# EAGLE design beacon1 (EAGLE 9.2.1)
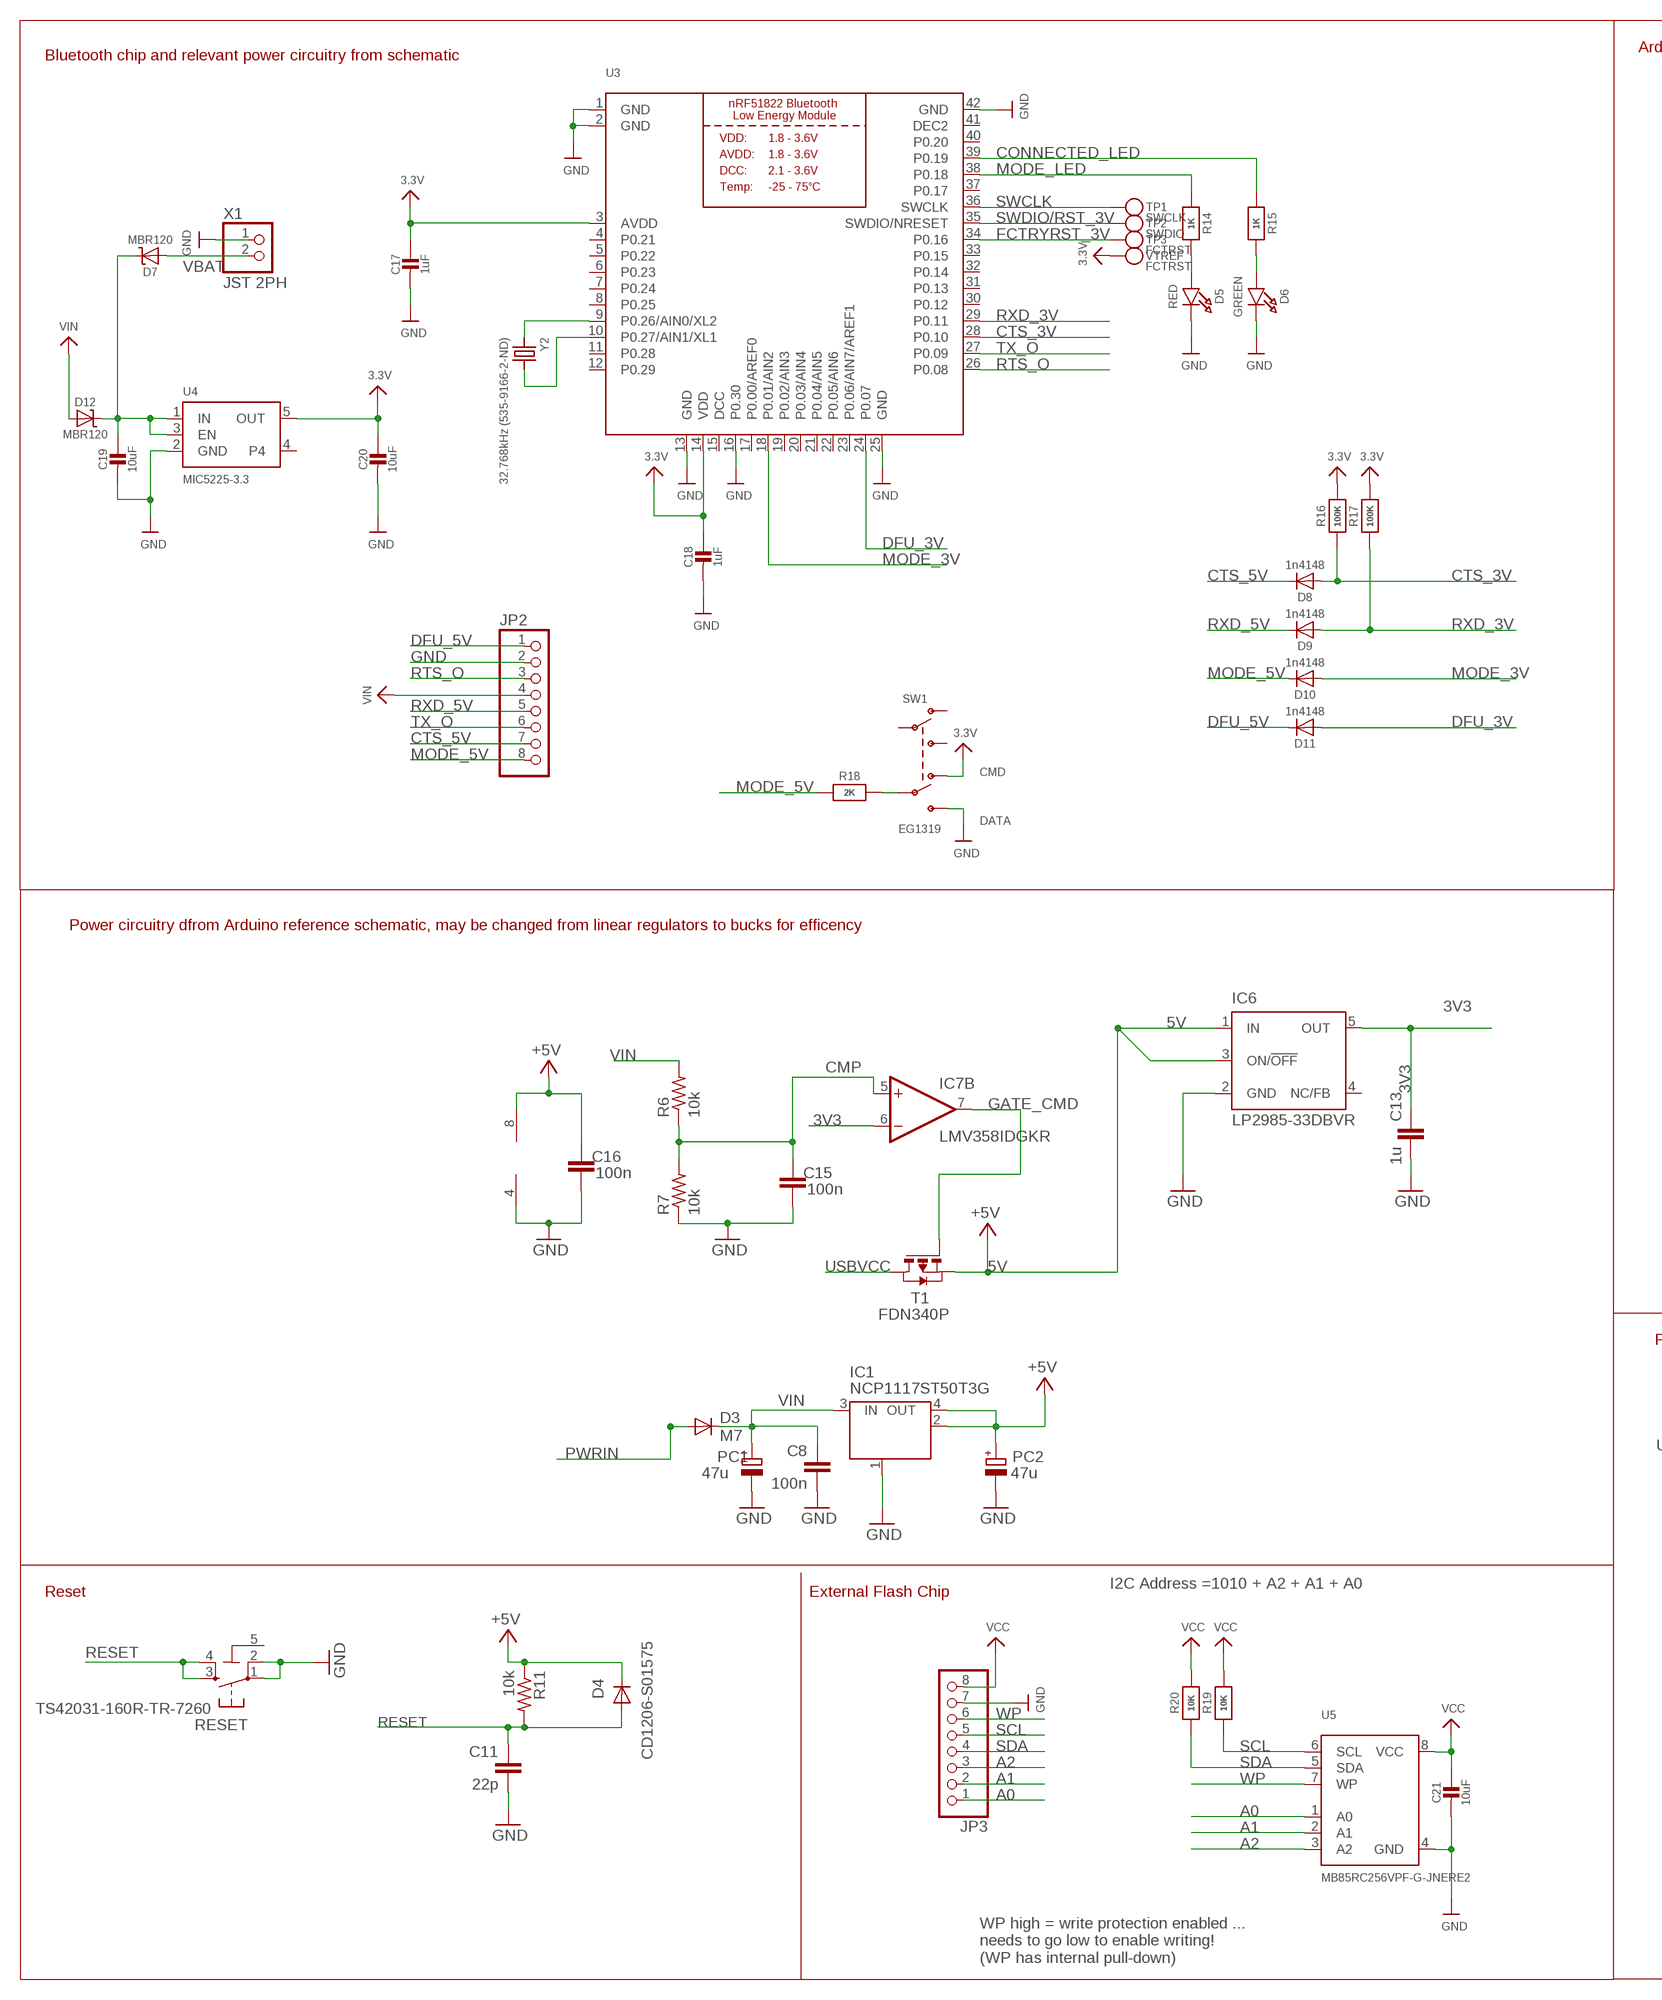
[diagram p0: schematic, sheet 1, part 1 of 2]
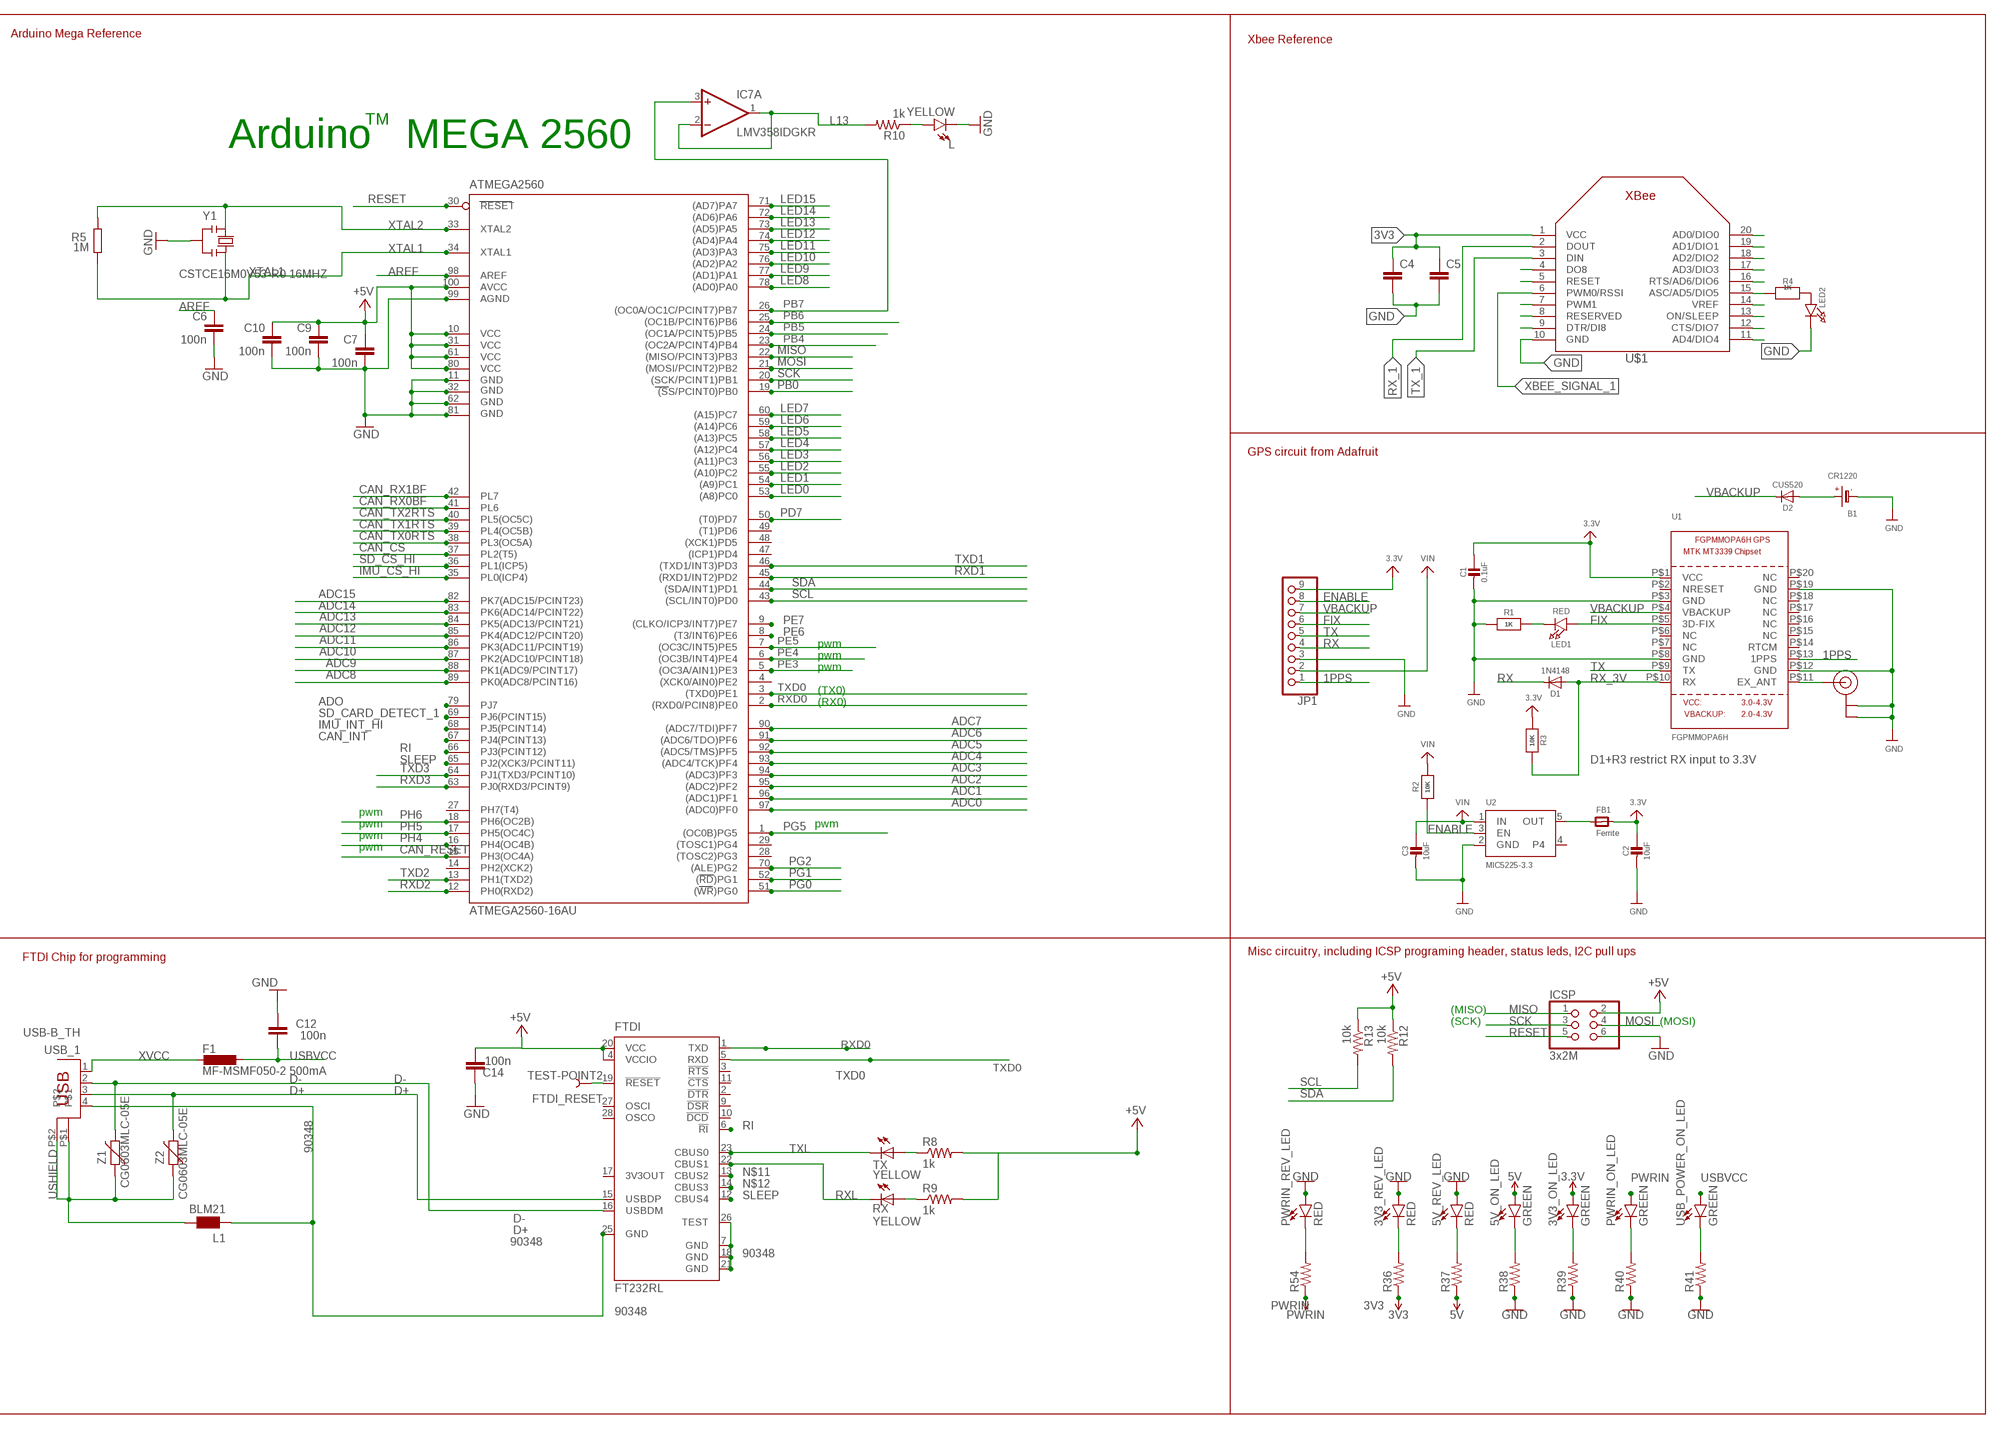
[diagram p1: schematic, sheet 1, part 2 of 2]

## Parts
3V3_ON_LED  GREEN  LED-GREENLILYPAD  [LED-1206]
3V3_REV_LED  RED  LED-RED1206  [LED-1206]
5V_ON_LED  GREEN  LED-GREENLILYPAD  [LED-1206]
5V_REV_LED  RED  LED-RED1206  [LED-1206]
ATMEGA2560  ATMEGA2560-16AU  ATMEGA2560AU  [TQFP100]
B1  CR1220  BATTERYCR1220_SMT  [CR1220]
C1  0.1uF  CAP_CERAMIC0805-NOOUTLINE  [0805-NO]
C2  10uF  CAP_CERAMIC0805-NOOUTLINE  [0805-NO]
C3  10uF  CAP_CERAMIC0805-NOOUTLINE  [0805-NO]
C4  CC1206  [C1206]
C5  CC1206  [C1206]
C6  100n  C-EUC1206K  [C1206K]
C7  100n  C-EUC1206K  [C1206K]
C8  100n  C-EUC1206K  [C1206K]
C9  100n  C-EUC1206K  [C1206K]
C10  100n  C-EUC1206K  [C1206K]
C11  22p  C-EUC1206K  [C1206K]
C12  100n  C-EUC1206K  [C1206K]
C13  1u  C-EUC1206K  [C1206K]
C14  100n  C-EUC1206K  [C1206K]
C15  100n  C-EUC1206K  [C1206K]
C16  100n  C-EUC1206K  [C1206K]
C17  1uF  CAP_CERAMIC0805-NOOUTLINE  [0805-NO]
C18  1uF  CAP_CERAMIC0805-NOOUTLINE  [0805-NO]
C19  10uF  CAP_CERAMIC0805-NOOUTLINE  [0805-NO]
C20  10uF  CAP_CERAMIC0805-NOOUTLINE  [0805-NO]
C21  10uF  CAP_CERAMIC_0805MP  [_0805MP]
D1  1N4148  DIODESOD-323  [SOD-323]
D2  CUS520  DIODESOD-323  [SOD-323]
D3  M7  DIODE-SMB  [SMB]
D4  CD1206-S01575  DIODE-MINIMELF  [MINIMELF]
D5  RED  LED0805_NOOUTLINE  [CHIPLED_0805_NOOUTLINE]
D6  GREEN  LED0805_NOOUTLINE  [CHIPLED_0805_NOOUTLINE]
D7  MBR120  DIODE-SCHOTTKYSOD-123  [SOD-123]
D8  1n4148  DIODESOD-323  [SOD-323]
D9  1n4148  DIODESOD-323  [SOD-323]
D10  1n4148  DIODESOD-323  [SOD-323]
D11  1n4148  DIODESOD-323  [SOD-323]
D12  MBR120  DIODE-SCHOTTKYSOD-123  [SOD-123]
F1  MF-MSMF050-2 500mA  L-EUL1812  [L1812]
FB1  Ferrite  FERRITE-0805NO  [0805-NO@1]
FTDI  FT232RL  [SSOP28]
FTDI_RESET  TEST-POINT2  [PAD.02X.02]
IC1  NCP1117ST50T3G  MC33269ST-3.3T3  [SOT223]
IC6  LP2985-33DBVR  LP2985-XXDBVR33  [SOT23-DBV]
IC7  LMV358IDGKR  LMV358MMX  [MSOP08]
ICSP  3x2M  PINHD-2X3  [2X03]
JP1  HEADER-1X970MIL  [1X09_ROUND_70]
JP2  HEADER-1X876MIL  [1X08_ROUND_76]
JP3  HEADER-1X870MIL  [1X08_ROUND_70]
L  YELLOW  LED1206  [LED-1206]
L1  BLM21  WE-CBF_0805  [0805]
LED1  RED  LED0805  [CHIPLED_0805]
LED2  LED1206  [CHIPLED_1206]
PC1  47u  CPOL-EUD  [PANASONIC_D]
PC2  47u  CPOL-EUD  [PANASONIC_D]
PWRIN_ON_LED  GREEN  LED-GREENLILYPAD  [LED-1206]
PWRIN_REV_LED  RED  LED-RED1206  [LED-1206]
R1  1K  RESISTOR0805_NOOUTLINE  [0805-NO]
R2  10K  RESISTOR0805_NOOUTLINE  [0805-NO]
R3  10K  RESISTOR0805_NOOUTLINE  [0805-NO]
R4  1K  RESISTOR0805_NOOUTLINE  [0805-NO]
R5  1M  R-EU_R1206  [R1206]
R6  10k  R-US_M1206  [M1206]
R7  10k  R-US_M1206  [M1206]
R8  1k  R-US_M1206  [M1206]
R9  1k  R-US_M1206  [M1206]
R10  1k  R-US_M1206  [M1206]
R11  10k  R-US_M1206  [M1206]
R12  10k  R-US_M1206  [M1206]
R13  10k  R-US_M1206  [M1206]
R14  1K  RESISTOR0805_NOOUTLINE  [0805-NO]
R15  1K  RESISTOR0805_NOOUTLINE  [0805-NO]
R16  100K  RESISTOR0805_NOOUTLINE  [0805-NO]
R17  100K  RESISTOR0805_NOOUTLINE  [0805-NO]
R18  2K  RESISTOR0805_NOOUTLINE  [0805-NO]
R19  10K  RESISTOR_0805MP  [_0805MP]
R20  10K  RESISTOR_0805MP  [_0805MP]
R36  R-US_M1206  [M1206]
R37  R-US_M1206  [M1206]
R38  R-US_M1206  [M1206]
R39  R-US_M1206  [M1206]
R40  R-US_M1206  [M1206]
R41  R-US_M1206  [M1206]
R54  R-US_M1206  [M1206]
RESET  TS42031-160R-TR-7260  TS42  [TS42]
RX  YELLOW  LEDSMT1206  [1206]
SW1  EG1319  SWITCH_DPDTEG1390  [EG1390]
T1  FDN340P  PMOSSOT23  [SOT-23]
TP1  SWCLK  TESTPOINT1.5X2.0MM_NOCREAM  [PAD-1.5X2.0]
TP2  SWDIO  TESTPOINT1.5X2.0MM_NOCREAM  [PAD-1.5X2.0]
TP3  FCTRST  TESTPOINT1.5X2.0MM_NOCREAM  [PAD-1.5X2.0]
TX  YELLOW  LEDSMT1206  [1206]
U1  FGPMMOPA6H  GPS_FGPMMOPA6H  [FGPMMOPA6H]
U2  MIC5225-3.3  VREG_SOT23-5  [SOT23-5]
U3  NRF51822_MODULE_MDBT40  [BLE_MODULE_RAYTAC_MDBT40]
U4  MIC5225-3.3  VREG_SOT23-5  [SOT23-5]
U5  MB85RC256VPF-G-JNERE2  FRAM_SOIC8_I2C  [SOIC8_208MIL]
U$1  XBEE  [XBEE]
U$20  U.FL  [U.FL]
USB_1  USB-B_TH  PN61729  [PN61729]
USB_POWER_ON_LED  GREEN  LED-GREENLILYPAD  [LED-1206]
VTREF  FCTRST  TESTPOINT1.5X2.0MM_NOCREAM  [PAD-1.5X2.0]
X1  JST 2PH  CON_JST_PH_2PIN  [JSTPH2]
Y1  CSTCE16M0V53-R0 16MHZ  RESONATORMU  [RESONATOR]
Y2  32.768kHz (535-9166-2-ND)  CRYSTAL2.0X6.0_32.768  [CRYSTAL_CYL_2X6MM_SMT]
Z1  CG0603MLC-05E  VARISTORCN0603  [CT/CN0603]
Z2  CG0603MLC-05E  VARISTORCN0603  [CT/CN0603]

## Nets
1PPS: JP1.1 U1.P$13(1PPS)
3.3V: C1.1 C2.1 C17.1 C18.1 C20.1 FB1.2 JP1.9 R3.1 R16.2 R17.2 SW1.O2 U1.P$1(VCC) U3.3(AVDD) U3.14(VDD) U4.5(OUT) VTREF.P$1
3V3 [power]: 3V3_ON_LED.A C4.1 C5.1 C13.2 IC6.5(OUT) IC7.6(B:-IN) R36.1 U$1.1(VCC) ; supply symbol labelled 3.3V
5V: 5V_ON_LED.A ATMEGA2560.10(VCC) ATMEGA2560.31(VCC1) ATMEGA2560.61(VCC2) ATMEGA2560.80(VCC3) ATMEGA2560.100(AVCC) C7.1 C9.1 C10.1 C14.1 C16.2 D4.C FTDI.4(VCCIO) FTDI.20(VCC) IC1.2(OUT) IC1.4(OUT) IC6.1(IN) IC6.3(ON/!OFF) IC7.8(P:V+) ICSP.2 PC2.+ R8.2 R9.2 R11.1 R12.1 R13.1 R37.1 T1.2(S) ; supply symbol labelled +5V
90348 [gnd]: 3V3_REV_LED.A 5V_REV_LED.A ATMEGA2560.11(GND) ATMEGA2560.32(GND1) ATMEGA2560.62(GND2) ATMEGA2560.81(GND3) ATMEGA2560.99(AGND) C6.2 C7.2 C8.2 C9.2 C10.2 C11.2 C12.2 C13.1 C14.2 C15.1 C16.1 FTDI.18(GND) FTDI.25(GND) IC1.1(GND/ADJ) IC6.2(GND) IC7.4(P:V-) ICSP.6 L1.1 L.C PC1.- PC2.- PWRIN_REV_LED.A R7.1 R38.1 R39.1 R40.1 R41.1 RESET.1 RESET.2 USB_1.4 Y1.2 ; supply symbol labelled GND
A0: JP3.1 U5.1(A0)
A1: JP3.2 U5.2(A1)
A2: JP3.3 U5.3(A2)
ADC0: ATMEGA2560.97((ADC0)PF0)
ADC1: ATMEGA2560.96((ADC1)PF1)
ADC2: ATMEGA2560.95((ADC2)PF2)
ADC3: ATMEGA2560.94((ADC3)PF3)
ADC4: ATMEGA2560.93((ADC4/TCK)PF4)
ADC5: ATMEGA2560.92((ADC5/TMS)PF5)
ADC6: ATMEGA2560.91((ADC6/TDO)PF6)
ADC7: ATMEGA2560.90((ADC7/TDI)PF7)
ADC8: ATMEGA2560.89(PK0(ADC8/PCINT16))
ADC9: ATMEGA2560.88(PK1(ADC9/PCINT17))
ADC10: ATMEGA2560.87(PK2(ADC10/PCINT18))
ADC11: ATMEGA2560.86(PK3(ADC11/PCINT19))
ADC12: ATMEGA2560.85(PK4(ADC12/PCINT20))
ADC13: ATMEGA2560.84(PK5(ADC13/PCINT21))
ADC14: ATMEGA2560.83(PK6(ADC14/PCINT22))
ADC15: ATMEGA2560.82(PK7(ADC15/PCINT23))
ADO: ATMEGA2560.79(PJ7)
AREF: ATMEGA2560.98(AREF) C6.1
CAN_CS: ATMEGA2560.37(PL2(T5))
CAN_INT: ATMEGA2560.67(PJ4(PCINT13))
CAN_RESET: ATMEGA2560.15(PH3(OC4A))
CAN_RX0BF: ATMEGA2560.41(PL6)
CAN_RX1BF: ATMEGA2560.42(PL7)
CAN_TX0RTS: ATMEGA2560.38(PL3(OC5A))
CAN_TX1RTS: ATMEGA2560.39(PL4(OC5B))
CAN_TX2RTS: ATMEGA2560.40(PL5(OC5C))
CMP: C15.2 IC7.5(B:+IN) R6.1 R7.2
CONNECTED_LED: R15.1 U3.39(P0.19)
CTS_3V: D8.A R16.1 U3.28(P0.10)
CTS_5V: D8.C JP2.7
D+: FTDI.15(USBDP) USB_1.3 Z2.2
D-: FTDI.16(USBDM) USB_1.2 Z1.2
DFU_3V: D11.A U3.24(P0.07)
DFU_5V: D11.C JP2.1
ENABLE: JP1.8 R2.1 U2.3(EN)
FCTRYRST_3V: TP3.P$1 U3.34(P0.16)
FIX: JP1.6 LED1.A U1.P$5(3D-FIX)
GATE_CMD: IC7.7(B:OUT) T1.3(G)
GND: B1.- C1.2 C2.2 C3.2 C4.2 C5.2 C17.2 C18.2 C19.2 C20.2 C21.2 D5.C D6.C JP1.3 JP2.2 JP3.7 LED2.C R1.1 SW1.S2 U1.P$3(GND) U1.P$8(GND) U1.P$12(GND) U1.P$19(GND) U2.2(GND) U3.1(GND) U3.2(GND) U3.13(GND) U3.16(P0.30) U3.25(GND) U3.42(GND) U4.2(GND) U5.4(GND) U$1.10(GND) U$20.P$1(GND) U$20.P$2(GND) X1.1
IMU_CS_HI: ATMEGA2560.35(PL0(ICP4))
IMU_INT_HI: ATMEGA2560.68(PJ5(PCINT14))
L13: IC7.1(A:OUT) IC7.2(A:-IN) R10.2
LED0: ATMEGA2560.53((A8)PC0)
LED1: ATMEGA2560.54((A9)PC1)
LED2: ATMEGA2560.55((A10)PC2)
LED3: ATMEGA2560.56((A11)PC3)
LED4: ATMEGA2560.57((A12)PC4)
LED5: ATMEGA2560.58((A13)PC5)
LED6: ATMEGA2560.59((A14)PC6)
LED7: ATMEGA2560.60((A15)PC7)
LED8: ATMEGA2560.78((AD0)PA0)
LED9: ATMEGA2560.77((AD1)PA1)
LED10: ATMEGA2560.76((AD2)PA2)
LED11: ATMEGA2560.75((AD3)PA3)
LED12: ATMEGA2560.74((AD4)PA4)
LED13: ATMEGA2560.73((AD5)PA5)
LED14: ATMEGA2560.72((AD6)PA6)
LED15: ATMEGA2560.71((AD7)PA7)
MISO: ATMEGA2560.22((MISO/PCINT3)PB3) ICSP.1
MODE_3V: D10.A U3.18(P0.01/AIN2)
MODE_5V: D10.C JP2.8 R18.1
MODE_LED: R14.1 U3.38(P0.18)
MOSI: ATMEGA2560.21((MOSI/PCINT2)PB2) ICSP.4
N$1: B1.+$1(+) B1.+$2(+) D2.A
N$2: LED1.C R1.2
N$3: FB1.1 U2.5(OUT)
N$4: U1.P$11(EX_ANT) U$20.P$3(SIGNAL)
N$6: LED2.A R4.2
N$7: L.A R10.1
N$8: FTDI.7(GND) FTDI.21(GND) FTDI.26(TEST)
N$9: FTDI.19(!RESET) FTDI_RESET.P$1
N$11: FTDI.13(CBUS2)
N$12: FTDI.14(CBUS3)
N$13: PWRIN_ON_LED.C R40.2
N$14: R41.2 USB_POWER_ON_LED.C
N$15: D5.A R14.2
N$16: D6.A R15.2
N$17: U3.9(P0.26/AIN0/XL2) Y2.1
N$18: U3.10(P0.27/AIN1/XL1) Y2.2
N$19: R18.2 SW1.P2
N$20: PWRIN_REV_LED.C R54.2
N$21: C19.1 D7.C D12.C U4.1(IN) U4.3(EN)
N$37: 3V3_REV_LED.C R36.2
N$48: 5V_ON_LED.C R38.2
N$54: R9.1 RX.A
N$55: R8.1 TX.A
N$60: U$1.4(DO8)
N$61: U$1.5(RESET)
N$63: U$1.7(PWM1)
N$64: U$1.8(RESERVED)
N$65: U$1.9(DTR/DI8)
N$66: U$1.20(AD0/DIO0)
N$67: U$1.19(AD1/DIO1)
N$68: U$1.18(AD2/DIO2)
N$69: U$1.17(AD3/DIO3)
N$70: U$1.16(RTS/AD6/DIO6)
N$71: R4.1 U$1.15(ASC/AD5/DIO5)
N$72: U$1.14(VREF)
N$73: U$1.13(ON/SLEEP)
N$74: U$1.12(CTS/DIO7)
N$75: U$1.11(AD4/DIO4)
N$110: 5V_REV_LED.C R37.2
N$120: 3V3_ON_LED.C R39.2
PB0: ATMEGA2560.19((SS/PCINT0)PB0)
PB4: ATMEGA2560.23((OC2A/PCINT4)PB4)
PB5: ATMEGA2560.24((OC1A/PCINT5)PB5)
PB6: ATMEGA2560.25((OC1B/PCINT6)PB6)
PB7: ATMEGA2560.26((OC0A/OC1C/PCINT7)PB7) IC7.3(A:+IN)
PD7: ATMEGA2560.50((T0)PD7)
PE3: ATMEGA2560.5((OC3A/AIN1)PE3)
PE4: ATMEGA2560.6((OC3B/INT4)PE4)
PE5: ATMEGA2560.7((OC3C/INT5)PE5)
PE6: ATMEGA2560.8((T3/INT6)PE6)
PE7: ATMEGA2560.9((CLKO/ICP3/INT7)PE7)
PG0: ATMEGA2560.51((WR)PG0)
PG1: ATMEGA2560.52((RD)PG1)
PG2: ATMEGA2560.70((ALE)PG2)
PG5: ATMEGA2560.1((OC0B)PG5)
PH4: ATMEGA2560.16(PH4(OC4B))
PH5: ATMEGA2560.17(PH5(OC4C))
PH6: ATMEGA2560.18(PH6(OC2B))
PWRIN [power]: D3.A PWRIN_ON_LED.A R54.1
RESET: ATMEGA2560.30(RESET) C11.1 D4.A ICSP.5 R11.2 RESET.3 RESET.4
RI: ATMEGA2560.66(PJ3(PCINT12)) FTDI.6(!RI)
RTS_O: JP2.3 U3.26(P0.08)
RX: D1.C JP1.4
RX_1: U$1.2(DOUT)
RX_3V: D1.A R3.2 U1.P$10(RX)
RXD0: ATMEGA2560.2((RXD0/PCIN8)PE0) FTDI.1(TXD)
RXD1: ATMEGA2560.45((RXD1/INT2)PD2)
RXD2: ATMEGA2560.12(PH0(RXD2))
RXD3: ATMEGA2560.63(PJ0(RXD3/PCINT9))
RXD_3V: D9.A R17.1 U3.29(P0.11)
RXD_5V: D9.C JP2.5
RXL: FTDI.22(CBUS1) RX.C
SCK: ATMEGA2560.20((SCK/PCINT1)PB1) ICSP.3
SCL: ATMEGA2560.43((SCL/INT0)PD0) JP3.5 R13.2 R19.1 U5.6(SCL)
SD_CARD_DETECT_1: ATMEGA2560.69(PJ6(PCINT15))
SD_CS_HI: ATMEGA2560.36(PL1(ICP5))
SDA: ATMEGA2560.44((SDA/INT1)PD1) JP3.4 R12.2 R20.1 U5.5(SDA)
SLEEP: ATMEGA2560.65(PJ2(XCK3/PCINT11)) FTDI.12(CBUS4)
SWCLK: TP1.P$1 U3.36(SWCLK)
SWDIO/RST_3V: TP2.P$1 U3.35(SWDIO/NRESET)
TX: JP1.5 U1.P$9(TX)
TX_1: U$1.3(DIN)
TX_O: JP2.6 U3.27(P0.09)
TXD0: ATMEGA2560.3((TXD0)PE1) FTDI.5(RXD)
TXD1: ATMEGA2560.46((TXD1/INT3)PD3)
TXD2: ATMEGA2560.13(PH1(TXD2))
TXD3: ATMEGA2560.64(PJ1(TXD3/PCINT10))
TXL: FTDI.23(CBUS0) TX.C
USBVCC [power usb]: C12.1 F1.1 T1.1(D) USB_POWER_ON_LED.A
USHIELD [gnd]: L1.2 USB_1.P$1 USB_1.P$2 Z1.1 Z2.1
VBACKUP: D2.C JP1.7 U1.P$4(VBACKUP)
VBAT: D7.A X1.2
VCC: C21.1 JP3.8 R19.2 R20.2 U5.8(VCC)
VIN: C3.1 C8.1 D3.C D12.A IC1.3(IN) JP1.2 JP2.4 PC1.+ R2.2 R6.2 U2.1(IN)
WP: JP3.6 U5.7(WP)
XBEE_SIGNAL_1: U$1.6(PWM0/RSSI)
XTAL1: ATMEGA2560.34(XTAL1) R5.1 Y1.3
XTAL2: ATMEGA2560.33(XTAL2) R5.2 Y1.1
XVCC [power usb]: F1.2 USB_1.1
Unconnected: ATMEGA2560.4((XCK0/AIN0)PE2) ATMEGA2560.14(PH2(XCK2)) ATMEGA2560.27(PH7(T4)) ATMEGA2560.28((TOSC2)PG3) ATMEGA2560.29((TOSC1)PG4) ATMEGA2560.47((ICP1)PD4) ATMEGA2560.48((XCK1)PD5) ATMEGA2560.49((T1)PD6) FTDI.2(!DTR) FTDI.3(!RTS) FTDI.9(!DSR) FTDI.10(!DCD) FTDI.11(!CTS) FTDI.17(3V3OUT) FTDI.27(OSCI) FTDI.28(OSCO) IC6.4(NC/FB) SW1.O1 SW1.P1 SW1.S1 U1.P$2(NRESET) U1.P$6(NC) U1.P$7(NC) U1.P$14(RTCM) U1.P$15(NC) U1.P$16(NC) U1.P$17(NC) U1.P$18(NC) U1.P$20(NC) U2.4 U3.4(P0.21) U3.5(P0.22) U3.6(P0.23) U3.7(P0.24) U3.8(P0.25) U3.11(P0.28) U3.12(P0.29) U3.17(P0.00/AREF0) U3.19(P0.02/AIN3) U3.20(P0.03/AIN4) U3.21(P0.04/AIN5) U3.22(P0.05/AIN6) U3.23(P0.06/AIN7/AREF1) U3.30(P0.12) U3.31(P0.13) U3.32(P0.14) U3.33(P0.15) U3.37(P0.17) U3.40(P0.20) U4.4

## Notes on the sheet
- Arduino Mega Reference
- Bluetooth chip and relevant power circuitry from schematic | Xbee Reference
- TM
- Arduino   MEGA 2560
- GPS circuit from Adafruit
- CMD
- DATA
- pwm
- pwm
- Power circuitry dfrom Arduino reference schematic, may be changed from linear regulators to bucks for efficency
- pwm
- (TX0)
- (RX0)
- D1+R3 restrict RX input to 3.3V
- pwm
- pwm | pwm
- pwm
- pwm
- Misc circuitry, including ICSP programing header, status leds, I2C pull ups
- FTDI Chip for programming
- (MISO)
- (SCK) | (MOSI)
- I2C Address =1010 + A2 + A1 + A0
- Reset | External Flash Chip
- WP high = write protection enabled ... 
  needs to go low to enable writing!  
  (WP has internal pull-down)

## Power pins joined to a net without a drawn wire
5-GND: RESET.5(5-GND)
DCC: U3.15(DCC)
DEC2: U3.41(DEC2)

## Library data of the parts
3V3_ON_LED 5V_ON_LED PWRIN_ON_LED USB_POWER_ON_LED = SparkFun-LED:LED-GREEN: Green SMD LED Used in manufacturing of various products at SparkFun Packages: 0603 - SMD 0603 package [Product Link] <http://www.futureelectronics.com/en/technologies/semiconductors/optoelectronics/leds/Pages/9894312-LTST-C190GKT.aspx?CrossPart=HSMG-C190&IM=0> LilyPad 1206 - SMD1206 LilyPad package [Product Link] <http://www.futureelectronics.com/en/Technologies/Product.aspx?ProductID=IN150NGHARVATEKCORPORATION2049943&IM=0> 1206 - SMD1206 package [Product Link] <http://www.futureelectronics.com/en/technologies/semiconductors/optoelectronics/leds/Pages/8315665-LTST-C150KGKT.aspx?IM=0> 1206 Bottom Mount -SMD 1206 Bottom Mount [Product Link] <http://www.digikey.com/product-detail/en/lite-on-inc/LTST-C230KGKT/160-1456-1-ND/386854> SparkFun Products: Pro Mini 328 -5V <https://www.sparkfun.com/products/821> RedBoard <https://www.sparkfun.com/products/12757> MP3 Trigger <https://www.sparkfun.com/products/13720> Makey Makey <https://www.sparkfun.com/products/11076>; PROD_ID: DIO-09910
3V3_REV_LED 5V_REV_LED PWRIN_REV_LED = SparkFun-LED:LED-RED: Red SMD LED Used in manufacturing of most products at SparkFun Packages: 0603 - SMD 0603 package [Product Link] <http://docs.avagotech.com/docs/AV02-0551EN> 0603 SMART - SMD 0603 SMART package ( more efficient and expensive)[Product Link] <http://www.osram-os.com/Graphics/XPic2/00077099_0.pdf> 1206 - SMD1206 package [Product Link] <https://www.sparkfun.com/datasheets/DevTools/LilyPad/Q150OVS4.pdff> SparkFun Products: Pro Mini 328 -5V <https://www.sparkfun.com/products/821> RedBoard <https://www.sparkfun.com/products/12757> IOIO-OTG <https://www.sparkfun.com/products/13613>; PROD_ID: DIO-09912
ATMEGA2560 = SparkFun-DigitalIC:ATMEGA2560: Atmel 100-pin 8-bit uC 64/128/256 Kbytes FLASH 4 Kbytes EEPROM 8 Kbytes SRAM 86 General Purpose I/O pins 12-channels16-bit PWM 4 x Serial USARTs 16-channels 10-bit A/D
B1 = microbuilder:BATTERY: CR1220 SMT - Digikey: 3001K-ND CD2032 BAT-HLD-001 - Digikey: BAT-HLD-001-ND
C1-C3 C17-C21 = microbuilder:CAP_CERAMIC: Ceramic Capacitors For new designs, use the packages preceded by an '_' character since they are more reliable: The following footprints should be used on most boards: _0402 - Standard footprint for regular board layouts _0603 - Standard footprint for regular board layouts _0805 - Standard footprint for regular board layouts _1206 - Standard footprint for regular board layouts For extremely tight-pitch boards where space is at a premium, the following 'micro-pitch' footprints can be used (smaller pads, no silkscreen outline, etc.): _0402MP - Micro-pitch footprint for very dense/compact boards _0603MP - Micro-pitch footprint for very dense/compact boards _0805MP - Micro-pitch footprint for very dense/compact boards _1206MP - Micro-pitch footprint for very dense/compact boards
C4 C5 = eagle-ltspice:C: CAPACITOR, European symbol; SPICEMODEL: NONE; SPICEPREFIX: C
C6-C16 = SmartPrj:C-EU: CAPACITOR, European symbol
D1 D2 D8-D11 = microbuilder:DIODE: Diode SMA Model Volts Amps Type Vf Ir Digikey # Notes SSA34-E3 40V 3A Schottky 480mV @ 3A 200uA @ 40V SSA34-E3/61TGITR-ND CDBA120-G 20V 1A Schottky 500mV @ 1A 500uA @ 20V 641-1014-6-ND REEL MBRA210 10V 2A Schottky 350mV @ 2A 700uA @ 10V MBRA210LT3 SOD-123 Model Volts Amps Type Vf Ir Order # Notes BAT54T1G 30V 200mA Schottky 800mV @ 200mA 2uA @ 25V BAT54T1GOSTR-ND B0530W 30V 500mA Schottky 430mV @ 500mA 130uA @ 30V B0530W-FDICT-ND REEL MBR120 20V 1A Schottky 340mV @ 1A MBR120VLSFT1GOSCT-ND SOD-323 Model Volts Amps Type Vf Ir Order # Notes PMEG2005EJ 20V 500mA Schottky 355mV @ 500mA 568-4110-1-ND ZLLS410 10V 570mA Schottky 380mV @ 570mA ZLLS410CT-ND 1N4148WS 75V 150mA Silicon/Simple 1V 1N4148WSFSCT-ND REEL SOD-523 Model Volts Amps Type Vf Ir Order # Notes BAT54XV2 30V 200mA Schottky 0.8V @ 100mA BAT54XV2CT-ND TB751S 30V 30mA Schottky RB751S-40TE61CT-ND SOT23-R/W (R = Solder Paste/Reflow Ovens, W = Hand-Soldering) Model Volts Amps Type Vf Ir Order # Notes BAT54FILM 40V 300mA Schottky 497-7162-1-ND POWERDI-5 Model Volts Amps Type Vf Ir Order # Notes PDS560 60V 5A Schottky 670mV @ 5A 150uA @ 60V PDS560DICT-ND
D3 D4 = diode:DIODE-: DIODE
D5 D6 LED1 LED2 = microbuilder:LED: LED
D7 D12 = microbuilder:DIODE-SCHOTTKY
F1 = rcl:L-EU: INDUCTOR, European symbol
FB1 = microbuilder:FERRITE: Ferrite Bead 0603 MMZ1608B121C - 120 Ohm @ 100MHz, 600mA, 0.15 Ohm DC Resistance - Digikey: 445-2164-1-ND BK1608HW121-T - 120 Ohm, 600mA Ferrite Chip - Digikey: 587-1876-2-ND 0805 HZ0805B272R-10 - 2.7K Ohm @ 100MHz, 200mA, 0.8 Ohm DC Resistance - Digikey: 240-2504-1-ND (see also Murata BLM21BD272SN1L) MMZ2012Y152B - 1.5K Ohm @ 100MHz, 500mA, 0.4 Ohm DC Resistance - Digikey: 445-1560-1-ND - Mainly for high frequency (80-400MHz) MMZ2012R102A - 1K Ohm @ 100MHz, 500mA, 0.3 Ohm DC Resistance - Digikey: 445-1555-2-ND - More general purpose (10-200MHz)
FTDI = ftdichip:FT232R: Source: http://www.ftdichip.com/Documents/DataSheets/DS_FT232R_v104.pdf; MPN: FT232RL; OC_FARNELL: 1146032; OC_NEWARK: 91K9918
FTDI_RESET = SparkFun-Connectors:TEST-POINT: SparkFun Test Points Bare copper test points for troubleshooting or In-Circuit-Testing. These are used by our Production team for verifying production board runs using pogo-pins on test beds. SparkFun Products: SparkFun LSM9DS1 Breakout <https://www.sparkfun.com/products/13284> SparkFun PSOC <https://www.sparkfun.com/products/13714> SparkFun Load Cell Amplifier <https://www.sparkfun.com/products/13879>
IC1 = linear:MC33269ST*: Adjustable Output Low Dropout Voltage Regulator 800 mA Source: http://www.onsemi.com/pub/Collateral/MC33269-D.PDF
IC6 = SmartPrj:LP2985-XXDBVR: ULTRALOW-POWER 50-mA LOW-DROPOUT LINEAR REGULATORS 50-mA Low-Dropout Regulator Source: http://focus.ti.com/lit/ds/symlink/tps77001.pdf
IC7 = linear:LMV358?*: Dual General Purpose, Low Voltage, Rail-to-Rail Output Operational Amplifiers Source: http://www.national.com/mpf/LM/LMV321.html http://www.national.com/dt/lmv_qual.pdf
ICSP = SmartPrj:PINHD-2X3: PIN HEADER
JP1 = microbuilder:HEADER-1X9: PIN HEADER
JP2 JP3 = microbuilder:HEADER-1X8: PIN HEADER
L = SparkFun-LED:LED: LED (Generic) Standard schematic elements and footprints for 5mm, 3mm, 1206, and 0603 sized LEDs. Generic LEDs with no color specified.
L1 = wuerth-elektronik:WE-CBF: SMD EMI Suppression Ferrite Beads - excellent anti-EMI properties - low DCR - impedances till 3000 ohms - rated current up to 6 A
PC1 PC2 = rcl:CPOL-EU: POLARIZED CAPACITOR, European symbol
R1-R4 R14-R20 = microbuilder:RESISTOR: Resistors For new designs, use the packages preceded by an '_' character since they are more reliable: The following footprints should be used on most boards: _0402 - Standard footprint for regular board layouts _0603 - Standard footprint for regular board layouts _0805 - Standard footprint for regular board layouts _1206 - Standard footprint for regular board layouts For extremely tight-pitch boards where space is at a premium, the following 'micro-pitch' footprints can be used (smaller pads, no silkscreen outline, etc.): _0402MP - Micro-pitch footprint for very dense/compact boards _0603MP - Micro-pitch footprint for very dense/compact boards _0805MP - Micro-pitch footprint for very dense/compact boards _1206MP - Micro-pitch footprint for very dense/compact boards
R5 = SmartPrj:R-EU_: RESISTOR, European symbol
R6-R13 = adafruit:R-US_: RESISTOR, American symbol
R36-R41 R54 = resistor:R-US_: RESISTOR, American symbol
RESET = SmartPrj:TS42: TS42 Dongnan Electronics Tact switch VDC 12V - 50mA
RX TX = led:LED: LED
SW1 = microbuilder:SWITCH_DPDT: Switch - DPDT A DPDT Switch acts like an SPDT switch, but has a pair of switches instead of just one. Vertical - 0.3A @ 6V SMT - Digikey: JS202011SCQN
T1 = zetex:PMOSSOT23: MOS FET; OC_FARNELL: unknown; OC_NEWARK: unknown
TP1-TP3 VTREF = microbuilder:TESTPOINT: Test Point Various test points for characterisation and PCB testing TESTPOINT_SMT - Compact Surface Mount Test Point [Digikey: 5016KTR-ND]
U1 = microbuilder:GPS_FGPMMOPA6H: GPS Module - MTK MT3339 Chipset, -165dBm sensitivity, 22 channels, 10Hz, auto-select external antenna options
U2 U4 = microbuilder:VREG_SOT23-5: SOT23-5 Fixed Voltage Regulators Part Current Out V Out V In V Dropout θJA (°C/W) TJ (°C) Digikey Part No. ADP121 150mA 3.3V 3.4-5.5V 0.09V @ 150mA -- -- ADP121-AUJZ33R7CT-ND ADP121 150mA 3.0V 3.1-5.5V 0.09V @ 150mA -- -- ADP121-AUJZ30R7CT-ND ADP122 300mA 3.3V 3.4-5.5V 0.085V @ 300mA -- -- ADP122AUJZ-3.3-R7CT-ND ADP1712 300mA 3.3V 3.5-5.5V 0.17V @ 300mA -- -- ADP1712AUJZ-3.3-R7TR-ND AP7311 (Low Cost) 150mA 3.3V 3.5-6V 0.15V @ 150mA -- -- AP7311-33WG-7DICT-ND LD39015M18R 150mA 1.8V 1.9V-5.5V 0.08V @ 100mA -- -- 497-6977-1-ND LP2985A-33DBVR 150mA 3.3V 3.3-16V 0.28V @ 150mA 206 150 296-18479-1-ND MCP1824T-3302E/OT 300mA 3.3V 3.5V-6V 0.2V @ 300mA -- -- MCP1824T-3302E/OTCT-ND MIC5205-2.5YM5 TR 150mA 2.5V 2.7-16V 0.165V @ 150mA -- -- 576-1257-2-ND MIC5205-3.0YM5 TR 150mA 3.0V 3.2V-16V 0.165V @ 150mA -- -- 576-1258-2-ND MIC5205-3.3YM5 TR 150mA 3.3V 3.5V-16V 0.165V @ 150mA -- -- 576-1259-2-ND TPS780330220 150mA 3.3V+2.2V 3.6-5.5V 250mV Max -- -- 296-23332-1-ND TDA3663/N1,135 100mA 3.3V 3.5-45V 0.18V @ 50mA -- -- 568-5343-1-ND Max operating temp can be calculated using θJA, TJ (max junction temperature), and power in watts. Set the "Maximum Ambient Temperature" until it reaches TJ ("Max Junction Temperature"), which is the absolute limit for safe use of the regulator: Heat Sink Temperature Calculator <http://www.daycounter.com/Calculators/Heat-Sink-Temperature-Calculator.phtml> For example, With 12V source into a 3.3V LP2985 and a 30mA load, we are dissipating (12V-3.3V) * 0.03A = 0.261W. With a θJA of 206 °C/W, a TJ of 150°C, and 261mW we can safely use the chip without a heat sink up to 75°C (=147.1°C Junction Temperature).
U3 = microbuilder:NRF51822_MODULE_MDBT40: nRF51822 Bluetooth Low Energy Module
U5 = microbuilder:FRAM_SOIC8_I2C: I2C FRAM - SOIC8 Package 256KBit (32Kx8) - MB85RC256VPF-G-JNERE2 - SOIC-8 200 Mil, 2.7-5.5V, -40°C-85°C
U$1 = adafruit:XBEE
U$20 = microbuilder:U.FL: U.FL Antenna Connector
USB_1 = SmartPrj:PN61729: BERG USB connector
X1 = microbuilder:CON_JST_PH_2PIN: JST 2-Pin Right-Angle Connector PH-Series - 4UConnector: 17311 SH-Series - 4UConnector: 07278
Y1 = SmartPrj:RESONATOR
Y2 = microbuilder:CRYSTAL: Crystals HC49UP - Surface Mount Crystal 4.0MHz 18pF +/-30ppm Surface Mount Crystal [Digikey: 535-9857-1-ND] 12.0 MHz Surface Mount Crystal [Digikey: 535-9869-6-ND] 25.0 MHz Surface Mount Crystal [Digikey: 535-9078-1-ND] 2.5 x 2.0mm - MEMs SMT Crystal 16.0 MHz 10pF 20ppm 2.5 x 2.0mm Crystal [Digikey -40-85°C: 535-10923-1-ND] 3.2 x 2.5mm - MEMs SMT Crystal 12.0 MHz 8pF 15ppm 3.2 x 2.5mm Crystal [Digikey: -10-70°C: 644-1047-1-ND -40-125°C: 644-1128-1-ND] 40~85°C cheaper: 644-1173-6-ND 16.0 MHz 8pF 15ppm 3.2 x 2.5mm Crystal [Digikey: -10-70°C: 644-1049-1-ND -40-125°C: 644-1129-2-ND]-40~85°C cheaper: 644-1175-6-ND 16.0 MHz 10pF 10ppm 3.2 x 2.5mm Crystal [Digikey: 644-1100-1-ND] 27.12 MHz 18pF 30ppm 3.2 x 2.5mm Crystal [Digikey: 887-1424-1-ND] 27.12MHz 10pF 10ppm 3.2 x 2.5mm Crystal [Digikey: 887-1329-1-ND] 4.9 x 1.8mm - MEMs SMT Crystal 32.768 KHz 12.5pF 20ppm 4.9 x 1.8mm Crystal [Digikey: SE2415CT-ND] 8.0 x 3.8mm - Surface Mount Crystal 32.768kHz 12.5pF 20ppm -40°C-85°C [Digikey: 535-9166-2-ND] Cylinder 32.768KHz Cylinder Crystal (2x6mm body) [Ex. Digikey: 300-8341-2-ND]
Z1 Z2 = varistor:VARISTOR: VARISTOR

## Net classes
1 power: width 0.61 mm, drill 0.406 mm, clearance 0.203 mm
2 gnd: width 0.305 mm, drill 0.406 mm, clearance 0.203 mm
3 power usb: width 0.508 mm, drill 0.406 mm, clearance 0.203 mm

## Board
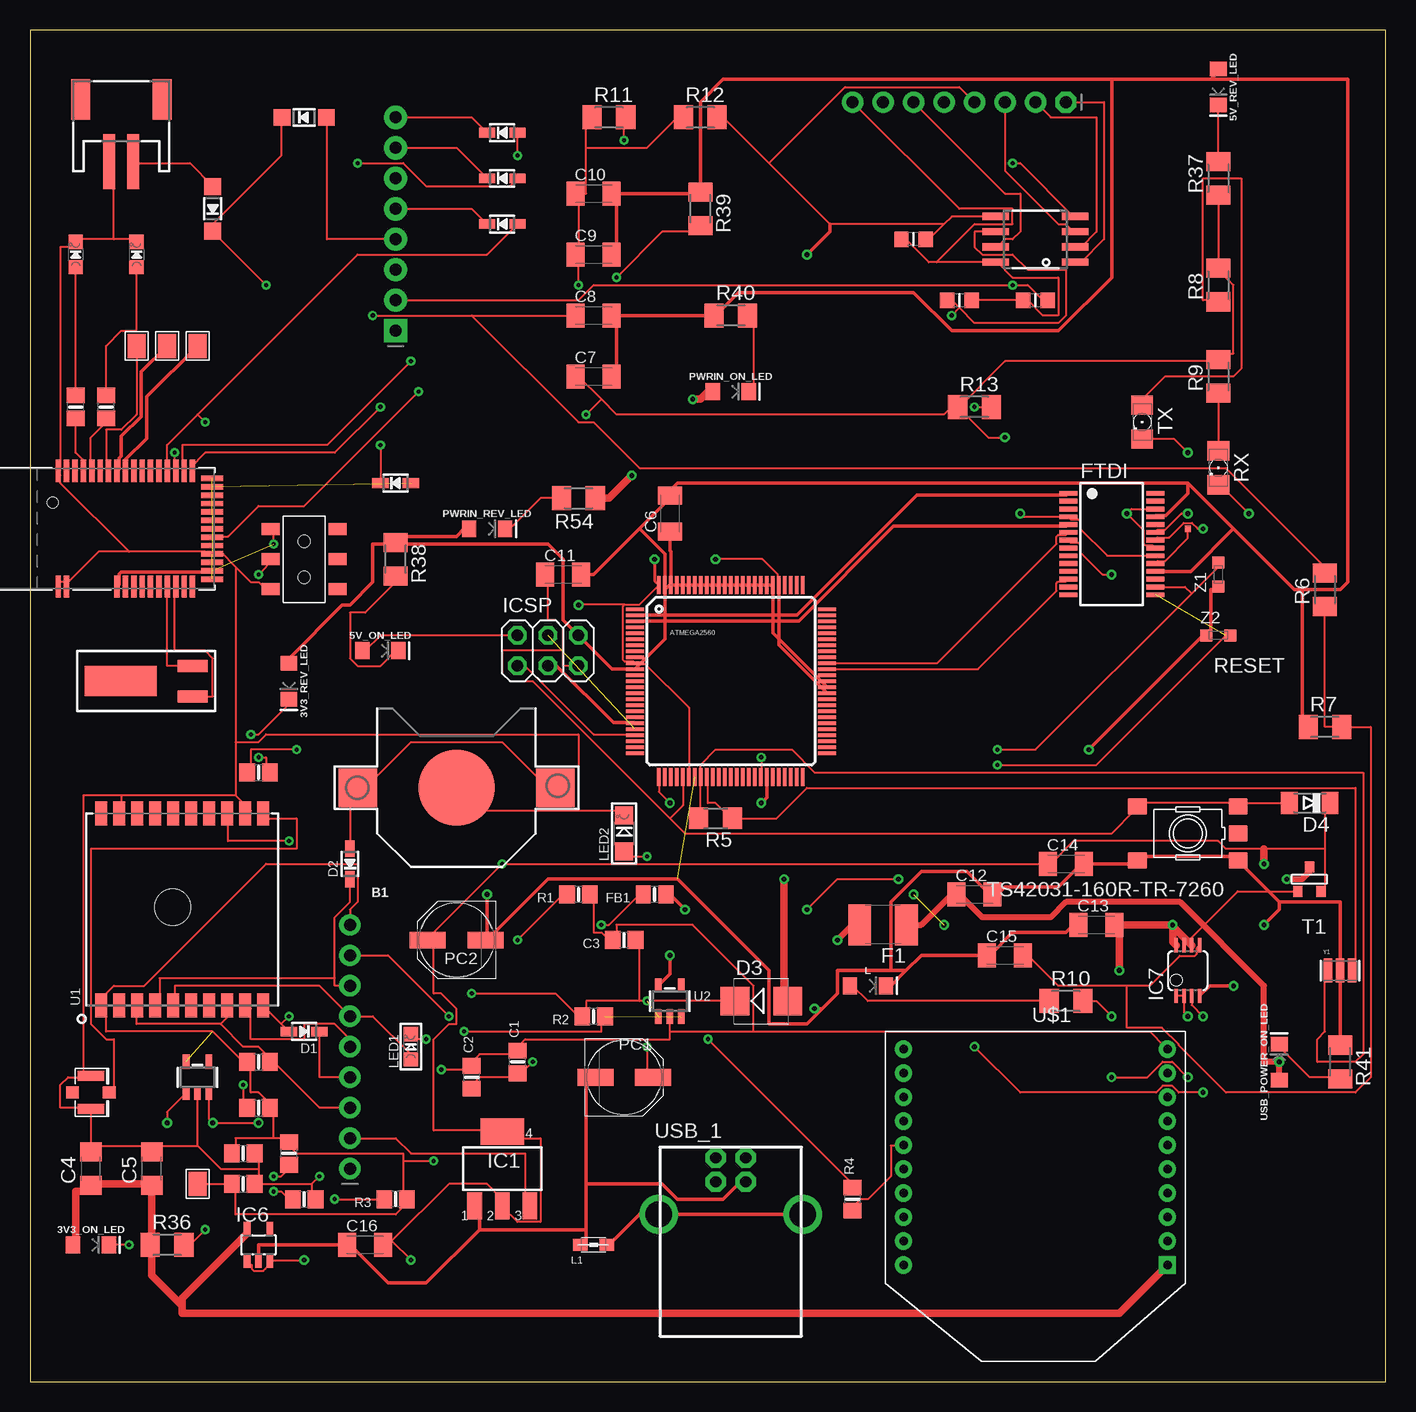
[diagram p2: board, top side]
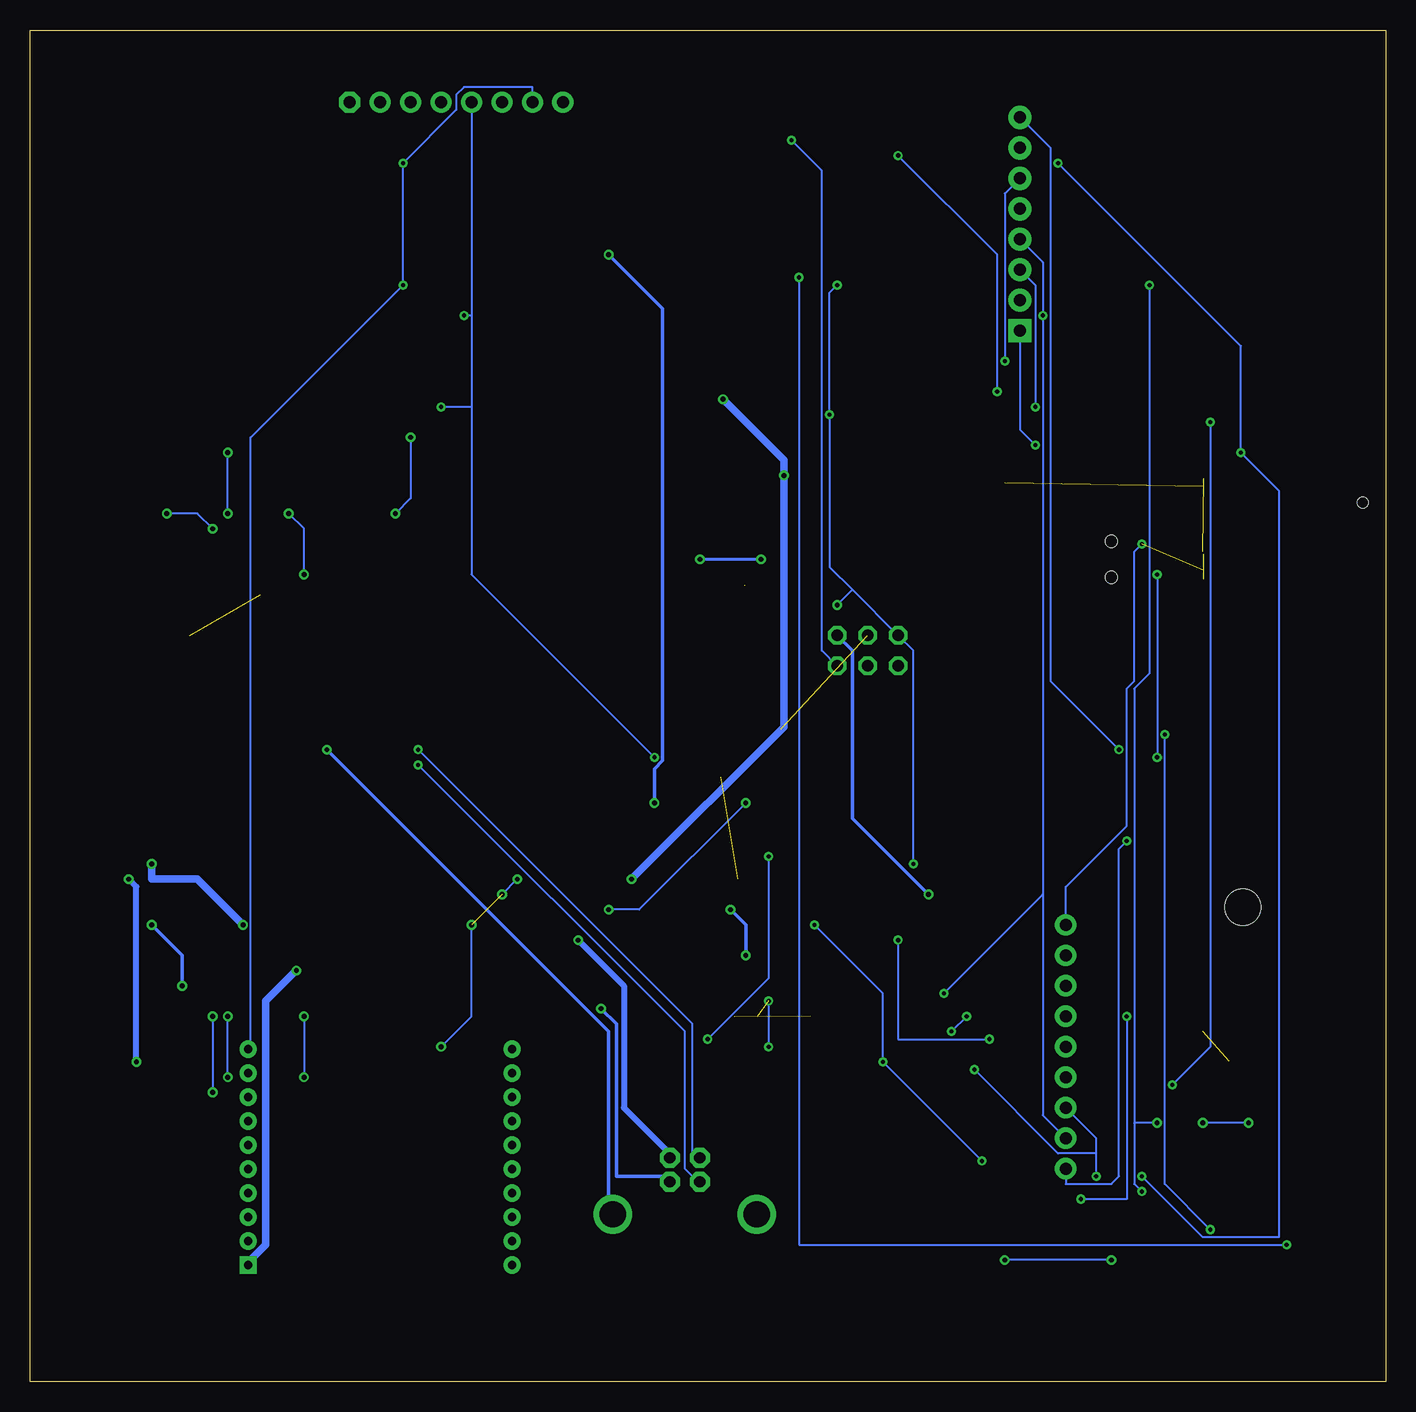
[diagram p3: board, bottom side, seen from below]

Size 113.01 x 112.7 mm. Coordinates in mm from the lower left corner, seen from the top.
Outline: 0,0 113.01,0 113.01,112.7 0,112.7 0,0
Copper layers (1*16): Top 0.035mm / dielectric 1.5mm / Bottom 0.035mm
Design rules "default": minimum track width 6mil, minimum drill 0.35mm, track to track 6mil, track to pad 6mil, pad to pad 6mil, via to via 6mil, smd to smd 6mil, copper to edge 40mil, drill to drill 6mil, minimum pad ring 10mil, minimum via ring 8mil, stop-mask expansion 4mil, vias tented up to drill 0mil, thermal gap 10mil

### Footprints (pad centres in the part's own frame; a part is rotated, then mirrored left to right if it is on the bottom)
LED-1206 = smd 1.2 x 1.4: A -1.5,0; C 1.5,0
TQFP100 = smd 1.5 x 0.3: 1 -8,6; 2 -8,5.5; 3 -8,5; 4 -8,4.5; 5 -8,4; 6 -8,3.5; 7 -8,3; 8 -8,2.5; 9 -8,2; 10 -8,1.5; 11 -8,1; 12 -8,0.5; 13 -8,0; 14 -8,-0.5; 15 -8,-1; 16 -8,-1.5; 17 -8,-2; 18 -8,-2.5; 19 -8,-3; 20 -8,-3.5; 21 -8,-4; 22 -8,-4.5; 23 -8,-5; 24 -8,-5.5; 25 -8,-6; 51 8,-6; 52 8,-5.5; 53 8,-5; 54 8,-4.5; 55 8,-4; 56 8,-3.5; 57 8,-3; 58 8,-2.5; 59 8,-2; 60 8,-1.5; 61 8,-1; 62 8,-0.5; 63 8,0; 64 8,0.5; 65 8,1; 66 8,1.5; 67 8,2; 68 8,2.5; 69 8,3; 70 8,3.5; 71 8,4; 72 8,4.5; 73 8,5; 74 8,5.5; 75 8,6 | smd 0.3 x 1.5: 26 -6,-8; 27 -5.5,-8; 28 -5,-8; 29 -4.5,-8; 30 -4,-8; 31 -3.5,-8; 32 -3,-8; 33 -2.5,-8; 34 -2,-8; 35 -1.5,-8; 36 -1,-8; 37 -0.5,-8; 38 0,-8; 39 0.5,-8; 40 1,-8; 41 1.5,-8; 42 2,-8; 43 2.5,-8; 44 3,-8; 45 3.5,-8; 46 4,-8; 47 4.5,-8; 48 5,-8; 49 5.5,-8; 50 6,-8; 76 6,8; 77 5.5,8; 78 5,8; 79 4.5,8; 80 4,8; 81 3.5,8; 82 3,8; 83 2.5,8; 84 2,8; 85 1.5,8; 86 1,8; 87 0.5,8; 88 0,8; 89 -0.5,8; 90 -1,8; 91 -1.5,8; 92 -2,8; 93 -2.5,8; 94 -3,8; 95 -3.5,8; 96 -4,8; 97 -4.5,8; 98 -5,8; 99 -5.5,8; 100 -6,8
CR1220 = smd 3.2 x 3.2: +$1 -8.225,0; +$2 8.225,0 | smd 6.35 x 6.35: - 0,0
0805-NO = smd 1.3 x 1.5: 1 -0.95,0; 2 0.95,0
C1206 = smd 1.6 x 1.8: 1 -1.4,0; 2 1.4,0
C1206K = smd 1.5 x 2: 1 -1.5,0; 2 1.5,0
_0805MP = smd 1.2 x 1.3: 1 -1.016,0; 2 1.016,0
SOD-323 = smd 1.35 x 0.8: A 1.27,0; C -1.27,0
SMB = smd 2.4 x 2.4: A 2.2,0; C -2.2,0
MINIMELF = smd 1.4 x 1.8: A 1.7,0; C -1.7,0
CHIPLED_0805_NOOUTLINE = smd 1.2 x 1.2: A 0,-1.05; C 0,1.05
SOD-123 = smd 1.4 x 1.4: A 1.85,0; C -1.85,0
L1812 = smd 1.9 x 3.4: 1 -1.95,0; 2 1.95,0
0805-NO@1 = smd 1.24 x 1.5: 1 -0.95,0; 2 0.95,0
SSOP28 = smd 0.4 x 1.5: 1 -4.225,-3.625; 2 -3.575,-3.625; 3 -2.925,-3.625; 4 -2.275,-3.625; 5 -1.625,-3.625; 6 -0.975,-3.625; 7 -0.325,-3.625; 8 0.325,-3.625; 9 0.975,-3.625; 10 1.625,-3.625; 11 2.275,-3.625; 12 2.925,-3.625; 13 3.575,-3.625; 14 4.225,-3.625; 15 4.225,3.625; 16 3.575,3.625; 17 2.925,3.625; 18 2.275,3.625; 19 1.625,3.625; 20 0.975,3.625; 21 0.325,3.625; 22 -0.325,3.625; 23 -0.975,3.625; 24 -1.625,3.625; 25 -2.275,3.625; 26 -2.925,3.625; 27 -3.575,3.625; 28 -4.225,3.625
PAD.02X.02 = smd 0.508 x 0.508: P$1 0,0
SOT223 = smd 1.219 x 2.235: 1 -2.311,-3.099; 2 0,-3.099; 3 2.311,-3.099 | smd 3.6 x 2.2: 4 0,3.099
SOT23-DBV = smd 0.55 x 1.2: 1 -0.95,-1.3; 2 0,-1.3; 3 0.95,-1.3; 4 0.95,1.3; 5 -0.95,1.3
MSOP08 = smd 0.3 x 1.2: 1 -0.976,-2.113; 2 -0.326,-2.113; 3 0.324,-2.113; 4 0.974,-2.113; 5 0.974,2.112; 6 0.324,2.112; 7 -0.326,2.112; 8 -0.976,2.112
2X03 = drill 0.95 pad 1.55 octagon: 1 -2.54,-1.27; 2 -2.54,1.27; 3 0,-1.27; 4 0,1.27; 5 2.54,-1.27; 6 2.54,1.27
1X09_ROUND_70 = drill 1 pad 1.778: 1 -10.16,0; 2 -7.62,0; 3 -5.08,0; 4 -2.54,0; 5 0,0; 6 2.54,0; 7 5.08,0; 8 7.62,0; 9 10.16,0
1X08_ROUND_76 = drill 1 pad 1.93 square: 1 -8.89,0 | drill 1 pad 1.93: 2 -6.35,0; 3 -3.81,0; 4 -1.27,0; 5 1.27,0; 6 3.81,0; 7 6.35,0; 8 8.89,0
1X08_ROUND_70 = drill 1 pad 1.778 octagon: 1 -8.89,0 | drill 1 pad 1.778: 2 -6.35,0; 3 -3.81,0; 4 -1.27,0; 5 1.27,0; 6 3.81,0; 7 6.35,0; 8 8.89,0
0805 = smd 1.2 x 1: 1 -1.1,0; 2 1.1,0
CHIPLED_0805 = smd 1.2 x 1.2: A 0,-1.05; C 0,1.05
CHIPLED_1206 = smd 1.5 x 1.5: A 0,-1.496; C 0,1.496
PANASONIC_D = smd 3 x 1.4: + 2.4,0; - -2.4,0
R1206 = smd 1.6 x 1.803: 1 -1.422,0; 2 1.422,0
M1206 = smd 1.6 x 2: 1 -1.4,0; 2 1.4,0
TS42 = smd 1.6 x 1.4: 1 -4.2,2.25; 2 4.2,2.25; 3 -4.2,-2.25; 4 4.2,-2.25; 5 -4.2,0
1206 = smd 1.6 x 1.803: A -1.422,0; C 1.422,0
EG1390 = smd 1 x 1.5: O1 -2.5,2.8; O2 -2.5,-2.8; P1 0,2.8; P2 0,-2.8; S1 2.5,2.8; S2 2.5,-2.8 | hole 1: 1.5,0; -1.5,0
SOT-23 = smd 0.787 x 0.889: 1 0.025,-1.016; 2 -0.94,1.016; 3 0.991,1.016
PAD-1.5X2.0 = smd 1.5 x 2: P$1 0,0
FGPMMOPA6H = smd 2 x 1: P$1 -8,6.75; P$2 -8,5.25; P$3 -8,3.75; P$4 -8,2.25; P$5 -8,0.75; P$6 -8,-0.75; P$7 -8,-2.25; P$8 -8,-3.75; P$9 -8,-5.25; P$10 -8,-6.75; P$11 8,-6.75; P$12 8,-5.25; P$13 8,-3.75; P$14 8,-2.25; P$15 8,-0.75; P$16 8,0.75; P$17 8,2.25; P$18 8,3.75; P$19 8,5.25; P$20 8,6.75 | hole 3: 0.2,0.8
SOT23-5 = smd 0.55 x 1.2: 1 -0.95,-1.3; 2 0,-1.3; 3 0.95,-1.3; 4 0.95,1.3; 5 -0.95,1.3
BLE_MODULE_RAYTAC_MDBT40 = smd 1.85 x 0.45: 1 -4.825,4; 2 -4.825,3.3; 3 -4.825,-0.9; 4 -4.825,-1.6; 5 -4.825,-2.3; 6 -4.825,-3; 7 -4.825,-3.7; 8 -4.825,-4.4; 9 -4.825,-5.1; 10 -4.825,-5.8; 11 -4.825,-6.5; 12 -4.825,-7.2; 26 4.825,-7.2; 27 4.825,-6.5; 28 4.825,-5.8; 29 4.825,-5.1; 30 4.825,-4.4; 31 4.825,-3.7; 32 4.825,-3; 33 4.825,-2.3; 34 4.825,-1.6; 35 4.825,-0.9; 36 4.825,-0.2; 37 4.825,0.5; 38 4.825,1.2; 39 4.825,1.9; 40 4.825,2.6; 41 4.825,3.3; 42 4.825,4 | smd 0.45 x 1.85: 13 -4.2,-8.825; 14 -3.5,-8.825; 15 -2.8,-8.825; 16 -2.1,-8.825; 17 -1.4,-8.825; 18 -0.7,-8.825; 19 0,-8.825; 20 0.7,-8.825; 21 1.4,-8.825; 22 2.1,-8.825; 23 2.8,-8.825; 24 3.5,-8.825; 25 4.2,-8.825 | hole 0.9: 2.2,4.45
SOIC8_208MIL = smd 0.6 x 2.2: 1 -1.905,-3.315; 2 -0.635,-3.315; 3 0.635,-3.315; 4 1.905,-3.315; 5 1.905,3.315; 6 0.635,3.315; 7 -0.635,3.315; 8 -1.905,3.315
XBEE = drill 0.7 pad 1.422 square: 1 -11,5.5 | drill 0.7 pad 1.422: 2 -11,3.5; 3 -11,1.5; 4 -11,-0.5; 5 -11,-2.5; 6 -11,-4.5; 7 -11,-6.5; 8 -11,-8.5; 9 -11,-10.5; 10 -11,-12.5; 11 11,-12.5; 12 11,-10.5; 13 11,-8.5; 14 11,-6.5; 15 11,-4.5; 16 11,-2.5; 17 11,-0.5; 18 11,1.5; 19 11,3.5; 20 11,5.5
U.FL = smd 2.2 x 0.85: P$1 0,1.375; P$2 0,-1.375 | smd 1.05 x 1: P$3 1.525,0; P$4 -1.525,0
PN61729 = drill 0.95 pad 1.676 octagon: 1 1.25,4.71; 2 -1.25,4.71; 3 -1.25,2.71; 4 1.25,2.71 | drill 2.2: P$1 -6,0; P$2 6,0
JSTPH2 = smd 1 x 4.6: 1 -1,-3.7; 2 1,-3.7 | smd 1.6 x 3.4: NC1 -3.4,1.5; NC2 3.4,1.5
RESONATOR = smd 0.7 x 2: 1 -1,0; 2 0,0; 3 1,0
CRYSTAL_CYL_2X6MM_SMT = smd 2.5 x 1: 1 2.125,1.27; 2 2.125,-1.27 | smd 6 x 2.5: CYLINDER -3.875,0
CT/CN0603 = smd 1 x 1: 1 -1,0; 2 1,0

### Placement (x,y rotation side)
3V3_ON_LED  5.08,11.43 0 top
3V3_REV_LED  21.59,58.42 270 top
5V_ON_LED  29.21,60.96 0 top
5V_REV_LED  99.06,107.95 270 top
ATMEGA2560  58.42,58.42 0 top
B1  35.56,49.53 0 top
C1  40.64,26.67 90 top
C2  36.83,25.4 90 top
C3  49.53,36.83 180 top
C4  5.08,17.78 90 top
C5  10.16,17.78 90 top
C6  53.34,72.39 90 top
C7  46.99,83.82 0 top
C8  46.99,88.9 0 top
C9  46.99,93.98 0 top
C10  46.99,99.06 0 top
C11  44.45,67.31 0 top
C12  78.74,40.64 0 top
C13  88.9,38.1 0 top
C14  86.36,43.18 0 top
C15  81.28,35.56 0 top
C16  27.94,11.43 0 top
C17  17.78,19.05 0 top
C18  17.78,16.51 0 top
C19  22.86,15.24 0 top
C20  19.05,26.67 0 top
C21  83.82,90.17 0 top
D1  22.86,29.21 180 top
D2  26.67,43.18 90 top
D3  60.96,31.75 0 top
D4  106.68,48.26 180 top
D5  8.89,93.98 0 top
D6  3.81,93.98 0 top
D7  15.24,97.79 90 top
D8  39.37,100.33 0 top
D9  39.37,96.52 0 top
D10  39.37,104.14 0 top
D11  30.48,74.93 0 top
D12  22.86,105.41 0 top
F1  71.12,38.1 180 top
FB1  52.07,40.64 180 top
FTDI  90.17,69.85 270 top
FTDI_RESET  96.52,71.12 0 top
IC1  39.37,17.78 0 top
IC6  19.05,11.43 0 top
IC7  96.52,34.29 0 top
ICSP  43.18,60.96 0 top
JP1  26.67,27.94 90 top
JP2  30.48,96.52 90 top
JP3  77.47,106.68 180 top
L  69.85,33.02 0 top
L1  46.99,11.43 0 top
LED1  31.75,27.94 0 top
LED2  49.53,45.72 0 top
PC1  49.53,25.4 0 top
PC2  35.56,36.83 180 top
PWRIN_ON_LED  58.42,82.55 0 top
PWRIN_REV_LED  38.1,71.12 0 top
R1  45.72,40.64 180 top
R2  46.99,30.48 180 top
R3  30.48,15.24 180 top
R4  68.58,15.24 90 top
R5  57.15,46.99 180 top
R6  107.95,66.04 90 top
R7  107.95,54.61 0 top
R8  99.06,91.44 90 top
R9  99.06,83.82 90 top
R10  86.36,31.75 0 top
R11  48.26,105.41 0 top
R12  55.88,105.41 0 top
R13  78.74,81.28 0 top
R14  6.35,81.28 90 top
R15  3.81,81.28 90 top
R16  21.59,19.05 90 top
R17  19.05,22.86 0 top
R18  19.05,50.8 0 top
R19  77.47,90.17 0 top
R20  73.66,95.25 180 top
R36  11.43,11.43 0 top
R37  99.06,100.33 90 top
R38  30.48,68.58 270 top
R39  55.88,97.79 270 top
R40  58.42,88.9 0 top
R41  109.22,26.67 270 top
R54  45.72,73.66 180 top
RESET  96.52,45.72 180 top
RX  99.06,76.2 270 top
SW1  22.86,68.58 270 top
T1  106.68,41.91 180 top
TP1  8.89,86.36 0 top
TP2  11.43,86.36 0 top
TP3  13.97,86.36 0 top
TX  92.71,80.01 270 top
U1  12.7,39.37 90 top
U2  53.34,31.75 0 top
U3  6.35,71.12 90 top
U4  13.97,25.4 0 top
U5  83.82,95.25 90 top
U$1  83.82,15.24 180 top
U$20  5.08,24.13 0 top
USB_1  58.42,13.97 0 top
USB_POWER_ON_LED  104.14,26.67 90 top
VTREF  13.97,16.51 0 top
X1  7.62,105.41 0 top
Y1  109.22,34.29 0 top
Y2  11.43,58.42 0 top
Z1  99.06,67.31 90 top
Z2  99.06,62.23 0 top

### Tracks (layer width: path | path; a pad name or v marks a point on that pad's centre or on a via)
1PPS  (via drill 0.35)
  Top 0.152: v21.59,45.09 16.51,45.09 16.51,46.99 U1.P$13
  Bottom 0.152: v21.59,45.09 22.23,44.45 22.23,17.14 22.86,16.51 26.67,16.51 JP1.1
3.3V  (via drill 0.35)  (2 unrouted)
  Top 0.152: v20.32,69.85 20.32,71.12 SW1.O2 | C2.1 36.83,24.77 37.47,25.4 40.64,25.4 C1.1 40.64,26.04 41.27,26.04 v41.91,26.67 | v47.62,38.1 48.26,38.1 50.8,40.64 FB1.2 | VTREF.P$1 C18.1 17.14,16.51 17.14,13.97 30.48,13.97 31.75,15.24 R3.1 31.11,15.24 31.11,18.41 | 20.32,20.32 21.59,20.32 R16.2 21.59,19.68 22.23,19.05 31.11,19.05 31.11,18.41 | 20.32,20.32 17.14,20.32 17.14,19.05 C17.1 | 20.32,20.32 20.32,22.86 | 20.32,22.86 19.05,24.13 18.41,24.13 18.41,26.67 C20.1 17.78,26.67 15.24,29.21 6.35,29.21 6.35,31.11 U1.P$1 5.71,31.75 6.99,33.02 9.53,33.02 19.68,43.18 27.3,43.18 27.3,40.01 26.67,39.37 JP1.9 | 20.32,22.86 R17.2 | 31.11,18.41 v33.66,18.41
  Top 0.305: U3.3 7.42,66.47 7.42,67.35 7.6,67.53 15.08,67.53 U3.14
  Bottom 0.152: v20.32,69.85 20.95,69.22 20.95,58.42 21.59,57.78 21.59,46.35 26.67,41.27 JP1.9 | v47.62,38.1 41.91,32.38 v41.91,26.67 v33.66,18.41
3V3  (via drill 0.41)
  Top 0.61: 10.16,11.43 10.16,8.89 12.7,6.35 | 10.16,11.43 C5.1 10.16,16.51 5.08,16.51 C4.1 5.08,15.88 3.81,15.88 3.81,11.43 3V3_ON_LED.A | v90.81,34.29 90.81,38.1 | 90.81,38.1 C13.2 | 10.16,11.43 R36.1 | U$1.1 94.61,9.53 90.81,5.71 12.7,5.71 12.7,6.35 | IC6.5 18.1,12.38 12.7,6.99 12.7,6.35 | IC7.6 95.15,38.1 90.81,38.1
  Bottom 0.61: v90.81,34.29 93.34,31.75 93.34,11.43 94.61,10.16 U$1.1
5V  (via drill 0.35, 0.41)
  Top 0.152: 45.72,99.06 45.72,93.98 | 46.35,102.87 46.35,99.06 45.72,99.06 | 46.35,102.87 46.35,105.41 R11.1 | 45.72,99.06 C10.1 | 46.35,102.87 51.44,102.87 53.98,105.41 R12.1 | ICSP.2 29.21,62.23 27.94,60.96 5V_ON_LED.A | R37.1 R8.2 99.06,92.71 100.33,91.44 100.33,85.72 99.06,85.72 R9.2 99.06,85.09 81.28,85.09 77.47,81.28 R13.1 | 47.62,81.92 48.9,80.64 76.2,80.64 76.83,81.28 R13.1 | 47.62,81.92 45.72,83.82 C7.1 | 47.62,81.92 v46.35,80.64 | v45.72,91.44 45.72,93.98 | 45.72,93.98 C9.1 | 107.95,44.45 107.95,48.26 D4.C | 107.95,44.45 107.95,41.27 T1.2 | 107.95,44.45 102.87,44.45 99.69,44.45 99.06,45.09 87,45.09 85.09,43.18 C14.1 v39.37,43.18 33.02,36.83 PC2.+ 33.66,36.83 33.66,32.38 34.29,32.38 35.56,31.11 35.56,29.84 34.92,29.84 33.66,28.57 33.66,20.95 39.37,20.95 IC1.4 39.37,20.32 42.55,20.32 42.55,13.34 40.64,13.34 39.37,14.61 IC1.2 39.37,15.24 38.1,16.51 34.92,16.51 30.16,11.75 | 30.16,11.75 29.84,11.43 C16.2 | IC6.3 20.32,10.13 | 20.32,10.13 22.83,10.13 v22.86,10.16 | v31.75,10.16 30.16,11.75 | 19.6,9.41 19.44,9.25 18.66,9.25 18.5,9.41 18.5,9.73 IC6.1 | 19.6,9.41 | 19.6,9.41 20.32,10.13 | ATMEGA2560.31 54.92,56.22 51.28,59.85 50.49,59.85 ATMEGA2560.10 50.3,60.04 49.58,60.04 49.44,60.17 49.44,64.67 49.58,64.8 | 49.58,64.8 50.8,64.8 ATMEGA2560.100 | 49.58,64.8 45.75,64.8 v45.72,64.77 | ATMEGA2560.80 62.35,66.49 62.35,67.29 61.05,68.58 v57.15,68.58 | R13.1 79.88,78.74 v81.28,78.74 | v82.55,72.39 82.81,72.12 FTDI.4 86.77,71.9 87.39,71.9 87.52,71.77 87.52,71.15 89.8,68.88 FTDI.20
  Top 0.254: v52.07,68.58 52.07,66.77 ATMEGA2560.100
  Top 0.305: ATMEGA2560.80 62.42,61.42 ATMEGA2560.61
  Top 0.61: IC7.8 95.25,36.7 v95.25,38.1 | v102.87,43.18 102.87,44.45
  Bottom 0.152: 44.45,66.04 46.35,67.94 v46.35,80.64 46.35,90.81 v45.72,91.44 | 44.45,66.04 ICSP.2 39.37,60.96 v39.37,43.18 | v22.86,10.16 v31.75,10.16 | v45.72,64.77 44.45,66.04 | v81.28,78.74 81.28,73.66 v82.55,72.39
  Bottom 0.254: v57.15,68.58 v52.07,68.58
  Bottom 0.61: v95.25,38.1 99.06,41.91 102.87,41.91 v102.87,43.18
90348  (via drill 0.41)  (1 unrouted)
  Top 0.305: IC6.2 19.05,11.43 C16.1 26.67,11.43 29.84,8.26 33.02,8.26 37.47,12.7 | 46.35,16.51 46.35,25.4 PC1.- | 46.35,16.51 46.35,12.7 | 46.35,12.7 46.35,11.43 L1.1 | 37.47,12.7 37.47,14.61 IC1.1 | 46.35,12.7 37.47,12.7 | 46.35,16.51 52.7,16.51 53.98,15.24 57.78,15.24 59.05,16.51 USB_1.4 | R41.1 Y1.2 109.22,40.01 104.14,40.01 | 104.14,40.01 100.97,43.18 RESET.1 100.33,43.81 92.71,43.81 RESET.2 92.08,43.18 C14.2 87.63,43.18 85.72,41.27 81.28,41.27 80.64,40.64 C12.2 80.01,40.64 78.11,42.55 74.3,42.55 71.75,40.01 71.75,34.29 | 73.03,34.29 74.3,35.56 C15.1 80.01,35.56 81.92,37.47 86.36,37.47 87,38.1 C13.1 | 73.03,34.29 71.75,33.02 L.C | 38.1,36.83 43.18,41.91 53.98,41.91 61.59,34.29 61.59,29.84 64.77,29.84 66.04,31.11 | 66.04,31.11 67.31,32.38 67.31,34.29 71.75,34.29 | 73.03,34.29 71.75,34.29 | 66.04,31.11 v65.41,31.11 | 50.8,71.12 46.99,67.31 C11.2 45.72,67.31 | 50.8,71.12 53.34,73.66 C6.2 53.34,74.3 53.98,74.93 96.52,74.93 | 30.48,69.85 28.57,69.85 28.57,66.67 26.67,64.77 26.04,64.77 21.59,60.33 3V3_REV_LED.A | PWRIN_REV_LED.A 36.2,71.12 35.56,70.48 30.48,70.48 R38.1 30.48,69.85 | 30.48,69.85 43.18,69.85 44.45,68.58 44.45,63.5 ICSP.6 48.53,59.42 ATMEGA2560.11 52.92,61.92 52.92,66.04 | 48.9,88.9 48.9,83.82 C7.2 | 48.9,88.9 R40.1 57.15,88.9 59.05,90.81 73.66,90.81 76.83,87.63 85.72,87.63 90.17,92.08 90.17,108.58 | 48.9,88.9 C8.2 | 48.9,99.06 48.9,93.98 C9.2 | 98.42,108.58 99.06,109.22 5V_REV_LED.A | 90.17,108.58 57.78,108.58 55.88,106.68 R39.1 55.88,99.06 48.9,99.06 | 90.17,108.58 98.42,108.58 | 106.05,66.04 106.05,54.61 R7.1 | 106.05,66.04 109.22,66.04 109.86,66.67 109.86,108.58 98.42,108.58
  Top 0.305: 48.9,99.06 C10.2 | 100.33,71.12 105.41,66.04 106.05,66.04 | 100.33,71.12 96.52,74.93 | v38.1,40.64 38.1,36.83 | 38.1,36.83 PC2.- | FTDI.18 96.78,67.58 100.33,71.12 | FTDI.25 93.89,72.22 94.69,72.22 96.52,74.05 96.52,74.93 | 50.8,71.12 52.92,69 ATMEGA2560.99 52.92,66.04 | IC7.4 98.34,33.02 v100.33,33.02 | v102.87,38.1 104.14,39.37 104.14,40.01 | ATMEGA2560.62 61.92,62.42 ATMEGA2560.81 53.3,66.42 52.92,66.04
  Bottom 0.305: v65.41,31.11 64.14,29.84 64.14,17.14 59.69,17.14 USB_1.4 | v38.1,40.64 44.45,46.99 44.45,60.96 ICSP.6 | v100.33,33.02 100.33,35.56 v102.87,38.1
A0
  Top 0.152: JP3.1 89.53,106.68 89.53,95.25 87.63,93.34 U5.1
A1
  Top 0.152: JP3.2 85.09,105.41 88.9,105.41 88.9,95.89 87.63,94.61 U5.2
A2
  Top 0.152: JP3.3 81.28,100.97 85.72,96.52 86.36,96.52 87,95.89 U5.3
AREF  (1 unrouted)
  Top 0.305: C6.1 53.34,69.3 53.43,69.21 ATMEGA2560.98
CMP
  Top 0.152: 91.44,33.02 93.34,33.02 95.85,35.52 97.11,35.52 97.27,35.69 97.27,36.18 IC7.5 | 91.44,33.02 85.72,33.02 83.19,35.56 C15.2 | R6.1 107.95,54.61 R7.2 111.76,54.61 111.76,25.4 110.49,24.13 99.69,24.13 95.76,28.07 95.76,28.13 94.37,29.52 91.44,29.52 91.44,33.02
CONNECTED_LED
  Top 0.152: R15.1 3.81,77.47 4.45,76.83 4.45,76.2 U3.39
CTS_3V  (via drill 0.35)
  Top 0.152: D8.A 40.01,99.69 33.02,99.69 31.11,101.6 v27.3,101.6 | v12.06,77.47 12.06,76.2 U3.28 | v20.32,17.14 20.95,17.14 21.59,17.78 R16.1
  Bottom 0.152: v27.3,101.6 12.06,86.36 v12.06,77.47 8.89,74.3 8.89,12.06 15.24,12.06 v20.32,17.14
CTS_5V
  Top 0.152: D8.C 35.56,102.87 JP2.7
D+  (via drill 0.35)  (1 unrouted)
  Top 0.152: v80.64,51.44 88.9,51.44 99.69,62.23 Z2.2
  Bottom 0.152: v80.64,51.44 58.42,29.21 58.42,17.78 57.78,17.14 USB_1.3
D-  (via drill 0.35)
  Top 0.152: 96.84,65.72 83.82,52.7 v80.64,52.7 | 96.84,65.72 99.06,67.94 Z1.2 | FTDI.16 96.28,66.28 96.84,65.72
  Bottom 0.152: v80.64,52.7 57.78,29.84 57.78,19.05 USB_1.2
DFU_3V  (1 unrouted)
DFU_5V  (via drill 0.35)
  Top 0.152: v29.21,78.11 D11.C
  Bottom 0.152: v29.21,78.11 30.48,79.38 JP2.1
ENABLE  (via drill 0.35)  (1 unrouted)
  Top 0.152: v36.2,29.21 47.62,29.21 47.62,30.48 R2.1 | v34.92,30.48 29.84,35.56 JP1.8
  Bottom 0.152: v34.92,30.48 v36.2,29.21
FCTRYRST_3V
  Top 0.305: U3.34 7.95,76.88 9.73,78.66 9.73,82.12 TP3.P$1
FIX
  Top 0.152: LED1.A 31.75,27.3 28.57,30.48 JP1.6 24.13,33.02 12.06,33.02 12.06,31.75 U1.P$5
GATE_CMD
  Top 0.152: IC7.7 100.69,40.89 T1.3
GND  (via drill 0.35)  (2 unrouted)
  Top 0.152: v81.92,101.6 82.55,101.6 87,97.16 U5.4 | JP2.2 45.72,90.17 46.99,91.44 v81.92,91.44 83.19,91.44 84.45,90.17 C21.2 | R1.1 46.99,40.64 46.99,37.47 47.62,37.47 48.26,36.83 C3.2 48.9,36.83 48.9,38.1 55.24,38.1 60.33,33.02 60.33,29.21 | 53.34,29.21 53.34,28.57 41.27,28.57 40.64,27.94 C1.2 40.64,27.3 37.47,27.3 36.83,26.67 C2.2 36.83,26.04 v34.29,26.04 | 53.34,29.21 U2.2 53.34,30.48 | 53.34,29.21 60.33,29.21 | 60.33,29.21 93.34,29.21 94.61,27.94 U$1.10 | 15.88,29.84 8.89,29.84 8.89,31.11 U1.P$3 | 15.88,29.84 16.51,30.48 16.51,31.11 U1.P$8 | 20.32,26.67 24.13,22.86 JP1.3 | 15.88,29.84 17.78,27.94 19.05,27.94 20.32,26.67 | 20.32,26.67 C20.2 | 19.05,17.78 19.05,19.05 C17.2 | 19.05,17.78 19.05,16.51 | 23.5,16.51 23.5,15.24 C19.2 | 19.05,16.51 23.5,16.51 | 19.05,16.51 C18.2 | 13.97,19.68 U4.2 13.97,24.13 | 10.16,19.68 13.97,19.68 | 5.08,19.68 U$20.P$2 5.08,22.86 2.54,22.86 2.54,24.77 3.17,25.4 4.45,25.4 | 4.45,25.4 5.08,25.4 U$20.P$1 4.45,25.4 | 5.08,19.68 10.16,19.68 | 10.16,19.68 C5.2 | 5.08,19.68 C4.2 | 19.05,17.78 15.88,17.78 13.97,19.68 | 23.5,16.51 v24.13,17.14 | 6.99,95.25 8.89,95.25 D5.C | 6.99,95.25 3.81,95.25 D6.C 3.81,94.61 2.54,94.61 2.54,76.2 U3.42 2.54,75.56 2.54,74.93 8.26,69.22 | 6.99,95.25 6.99,101.6 X1.1 | 45.72,47.62 37.47,47.62 B1.- | 45.72,47.62 49.53,47.62 LED2.C | 7.62,48.9 7.62,47.62 U1.P$19 | 17.14,48.9 7.62,48.9 | 17.14,48.9 18.41,47.62 U1.P$12 | 3.17,66.67 2.54,66.67 U3.1 | 17.14,67.94 15.88,69.22 15.24,69.22 U3.16 14.61,69.22 8.26,69.22 | 17.14,67.94 18.41,66.67 19.05,66.67 19.68,66.04 SW1.S2 | 3.17,66.67 5.71,69.22 8.26,69.22 | 3.17,66.67 U3.2 | 17.14,67.94 17.14,53.34 | 17.14,53.34 17.14,48.9
  Top 0.152: 45.72,47.62 45.72,53.98 19.68,53.98 19.05,53.34 17.14,53.34 | 4.45,25.4 4.45,48.9 7.62,48.9
  Bottom 0.152: JP3.7 71.12,107.95 76.83,107.95 77.47,107.31 77.47,106.05 v81.92,101.6 v81.92,91.44 94.61,78.74 94.61,27.94 U$1.10 | JP1.3 24.13,20.32 24.13,19.05 | v24.13,17.14 24.13,19.05 | v34.29,26.04 27.3,19.05 24.13,19.05
L13  (via drill 0.41)
  Top 0.152: IC7.1 IC7.2 96.19,30.81 v96.52,30.48 | R10.2 88.9,31.75 v90.17,30.48 | v90.17,25.4 93.15,25.4 94.43,26.68 95.21,26.68 96.49,25.4 v96.52,25.4
  Bottom 0.152: v90.17,30.48 v90.17,25.4 | v96.52,25.4 v96.52,30.48
MISO
  Top 0.152: ICSP.1 41.27,59.69 46.99,53.98 50.16,53.98 ATMEGA2560.22
MODE_3V  (via drill 0.35)
  Top 0.152: v40.64,102.23 D10.A | v32.38,82.55 22.86,73.03 19.05,73.03 16.51,70.48 15.24,70.48 U3.18
  Bottom 0.152: v40.64,102.23 32.38,93.98 v32.38,82.55
MODE_5V  (via drill 0.35)
  Top 0.152: D10.C 36.83,105.41 JP2.8 | v22.23,52.7 18.41,52.7 18.41,50.8 R18.1
  Bottom 0.152: v22.23,52.7 27.94,58.42 27.94,102.87 JP2.8
MODE_LED
  Top 0.152: R14.1 6.35,80.01 5.08,78.74 5.08,76.2 U3.38
MOSI  (1 unrouted)
N$1
  Top 0.152: D2.A 26.67,49.53 B1.+$1 27.94,49.53 31.75,53.34 39.37,53.34 43.18,49.53 B1.+$2
N$2  (via drill 0.35)
  Top 0.152: v33.02,28.57 31.75,28.57 LED1.C | v40.64,36.83 44.45,40.64 R1.2
  Bottom 0.152: v33.02,28.57 40.64,28.57 v40.64,36.83
N$3  (via drill 0.41)
  Top 0.305: U2.5 53.34,34 v53.34,35.56 | v54.61,39.37 53.34,40.64 FB1.1
  Bottom 0.305: v53.34,35.56 53.34,38.1 v54.61,39.37
N$4
  Top 0.152: U$20.P$3 6.99,24.13 6.99,28.57 6.35,28.57 5.08,29.84 5.08,44.45 22.23,44.45 22.23,46.99 19.68,46.99 U1.P$11
N$6  (via drill 0.35)
  Top 0.152: v56.52,28.57 68.58,16.51 R4.2 | v51.44,43.81 49.53,43.81 LED2.A
  Bottom 0.152: v56.52,28.57 51.44,33.66 v51.44,43.81
N$7
  Top 0.152: R10.1 69.85,31.75 68.58,33.02 L.A
N$8  (via drill 0.41)
  Top 0.152: v90.17,67.31 89.41,67.31 87.52,69.2 87.52,69.82 87.39,69.95 86.77,69.95 FTDI.7 | FTDI.26 91.83,72.78 v91.44,72.39 92.82,71.01 92.82,69.88 92.95,69.75 93.57,69.75 FTDI.21
  Bottom 0.152: v90.17,67.31 90.17,71.12 v91.44,72.39
N$9
  Top 0.152: FTDI.19 94.02,68.45 94.64,68.45 96.52,70.33 FTDI_RESET.P$1
N$13
  Top 0.152: PWRIN_ON_LED.C 60.33,82.55 60.33,88.9 R40.2
N$14
  Top 0.152: USB_POWER_ON_LED.C 104.14,27.94 106.68,25.4 109.22,25.4 R41.2
N$15
  Top 0.152: D5.A 8.89,87.63 7.62,87.63 6.35,86.36 R14.2
N$16
  Top 0.152: R15.2 D6.A
N$17
  Top 0.152: Y2.1 11.43,59.69 11.43,66.04 U3.9
N$18
  Top 0.152: Y2.2 15.24,57.15 15.24,60.33 14.61,60.96 12.06,60.96 12.06,66.04 U3.10
N$19  (via drill 0.35)
  Top 0.152: v19.05,52.07 19.68,52.07 19.68,50.8 R18.2 | v19.05,67.31 20.32,68.58 SW1.P2
  Bottom 0.152: v19.05,67.31 v19.05,52.07
N$20
  Top 0.152: R54.2 42.55,73.66 40.01,71.12 PWRIN_REV_LED.C
N$21  (via drill 0.35, 0.41)
  Top 0.152: D12.C 20.95,105.41 20.95,102.23 15.24,96.52 D7.C 15.24,95.89 v19.68,91.44 | v20.32,15.88 20.95,15.88 21.59,15.24 C19.1 | U4.1 11.43,22.51 v11.43,21.59 | U4.3 14.92,21.91 v15.24,21.59 v19.05,21.59
  Bottom 0.152: v20.32,15.88 20.95,16.51 20.95,21.59 | 20.95,21.59 20.95,57.78 19.68,59.05 v19.68,91.44 | v11.43,21.59 v15.24,21.59 | v19.05,21.59 20.95,21.59
N$37  (via drill 0.35)
  Top 0.152: v18.41,53.98 19.05,53.98 21.59,56.52 3V3_REV_LED.C | v14.61,12.7 13.34,11.43 R36.2
  Bottom 0.152: v18.41,53.98 18.41,16.51 v14.61,12.7
N$48
  Top 0.152: 5V_ON_LED.C 30.48,60.96 29.21,59.69 27.3,59.69 26.67,60.33 26.67,64.14 27.94,64.14 30.48,66.67 R38.2
N$54
  Top 0.152: R9.1 RX.A
N$55
  Top 0.152: TX.A 92.71,81.92 94.61,83.82 100.33,83.82 100.97,84.45 100.97,100.33 97.79,100.33 97.79,90.17 99.06,90.17 R8.1
N$71
  Top 0.152: R4.1 68.58,14.61 69.22,15.24 69.85,15.24 71.75,17.14 71.75,19.68 72.39,19.68 U$1.15
N$110
  Top 0.152: R37.2 5V_REV_LED.C
N$120  (via drill 0.35)
  Top 0.152: v8.26,11.43 3V3_ON_LED.C | v48.9,92.08 52.7,95.89 55.88,95.89 R39.2
  Bottom 0.152: v8.26,11.43 48.9,11.43 v48.9,92.08
PB7  (via drill 0.41)  (1 unrouted)
  Top 0.152: ATMEGA2560.26 52.42,49.18 v53.34,48.26 | v64.77,39.37 67.31,41.91 v72.39,41.91 | IC7.3 96.84,31.43 v97.79,30.48 | v78.74,27.94 82.55,24.13 93.88,24.13 94.43,24.68 95.21,24.68 95.76,24.13 v97.79,24.13
  Bottom 0.152: v53.34,48.26 62.23,39.37 v64.77,39.37 | v72.39,41.91 v73.66,40.64 | v97.79,30.48 v97.79,24.13 | v78.74,27.94 76.2,30.48 v76.2,38.1
PWRIN  (via drill 0.41)
  Top 0.61: v55.24,81.92 55.88,81.92 56.52,82.55 PWRIN_ON_LED.A | v50.16,75.56 48.26,73.66 R54.1 | v62.87,41.91 62.87,31.75 D3.A
  Bottom 0.61: v55.24,81.92 50.16,76.83 v50.16,75.56 50.16,54.61 v62.87,41.91
RESET  (via drill 0.35)
  Top 0.152: D4.A 100.97,48.26 RESET.3 100.33,48.26 92.71,48.26 RESET.4 92.08,47.62 90.17,45.72 54.61,45.72 53.34,46.99 | 44.45,60.96 44.45,59.69 ICSP.5 | 44.45,60.96 44.45,62.87 43.81,63.5 43.18,63.5 43.18,67.31 C11.1 | v49.53,103.5 49.53,105.41 R11.2 | 53.34,46.99 41.91,58.42 40.01,58.42 39.37,59.05 39.37,60.96 44.45,60.96 | ATMEGA2560.30 54.42,48.07 53.34,46.99
  Bottom 0.152: v49.53,103.5 46.99,100.97 46.99,60.96 ICSP.5
RI
  Top 0.152: ATMEGA2560.66 75.64,59.92 85.57,69.85 85.57,70.47 85.7,70.6 86.32,70.6 FTDI.6
RTS_O  (via drill 0.35)
  Top 0.152: v29.21,81.28 25.4,77.47 14.61,77.47 13.34,76.2 U3.26
  Bottom 0.152: v29.21,81.28 29.21,91.44 JP2.3
RX
  Top 0.152: D1.C 24.13,25.4 JP1.4
RX_3V  (via drill 0.35)
  Top 0.152: 20.95,29.84 19.68,31.11 U1.P$10 | 20.95,29.84 D1.A | v25.4,15.24 R3.2 | 20.95,29.84 v21.59,30.48
  Bottom 0.152: v25.4,15.24 21.59,15.24 v21.59,30.48
RXD0
  Top 0.305: FTDI.1 86.4,73.93 73.95,73.93 63.94,63.92 ATMEGA2560.2
RXD_3V  (via drill 0.35)
  Top 0.152: D9.A 38.1,93.98 27.3,93.98 13.97,80.64 | 13.97,80.64 11.43,78.11 11.43,76.2 U3.29 | v17.78,24.77 17.78,22.86 R17.1 | 13.97,80.64 v14.61,80.01
  Bottom 0.152: v17.78,24.77 14.61,27.94 v14.61,80.01
RXD_5V
  Top 0.152: D9.C 36.83,97.79 JP2.5
RXL  (via drill 0.41)
  Top 0.152: FTDI.22 94.02,70.4 94.97,70.4 96.17,71.6 96.87,71.6 97.35,71.12 v97.79,71.12 | v101.6,72.39 99.21,74.78 RX.C
  Bottom 0.152: v97.79,71.12 99.06,72.39 v101.6,72.39
SCK
  Top 0.305: ATMEGA2560.20 50.38,54.97 48.64,54.97 43.91,59.69 ICSP.3
SCL  (via drill 0.35)
  Top 0.152: 77.47,89.53 78.74,88.27 85.72,88.27 86.36,88.9 86.36,92.71 83.19,92.71 81.92,93.98 79.38,93.98 78.74,94.61 78.74,95.89 U5.6 | 77.47,89.53 76.83,90.17 R19.1 | v60.96,52.07 60.96,50.8 ATMEGA2560.43 | v78.74,81.28 R13.2 | v76.83,88.9 77.47,89.53
  Bottom 0.152: v60.96,52.07 76.2,67.31 76.2,81.28 | JP3.5 76.2,88.9 | 76.2,88.9 76.2,81.28 | 76.2,81.28 v78.74,81.28 | 76.2,88.9 v76.83,88.9
SDA  (via drill 0.41)
  Top 0.152: 76.2,96.52 76.83,97.16 U5.5 | 76.2,96.52 74.93,95.25 R20.1 | 61.59,101.6 66.67,96.52 76.2,96.52 | 61.59,101.6 57.78,105.41 R12.2 | JP3.4 77.47,107.95 67.94,107.95 61.59,101.6
  Top 0.305: ATMEGA2560.44 61.42,48.72 v60.96,48.26 | 66.67,96.52 66.67,95.89 v64.77,93.98
  Bottom 0.305: v60.96,48.26 60.96,51.1 60.28,51.79 60.28,89.49 v64.77,93.98
SLEEP
  Top 0.152: ATMEGA2560.65 79.04,59.42 85.57,65.95 85.57,66.57 85.7,66.7 86.32,66.7 FTDI.12
SWCLK
  Top 0.152: TP1.P$1 8.89,80.64 7.62,79.38 6.35,79.38 6.35,76.2 U3.36
SWDIO/RST_3V
  Top 0.305: U3.35 7.42,76.11 7.42,77 7.62,77.2 7.62,78.84 9.27,80.49 9.27,84.2 TP2.P$1
TX
  Top 0.152: JP1.5 26.67,28.57 25.4,29.84 22.86,29.84 22.86,28.57 18.41,28.57 18.41,31.11 U1.P$9
TX_O  (via drill 0.35)
  Top 0.152: v31.75,85.09 24.77,78.11 12.7,78.11 12.7,76.2 U3.27
  Bottom 0.152: v31.75,85.09 31.75,99.06 JP2.6
TXD0
  Top 0.305: FTDI.5 86.4,71.33 72,71.33 64.09,63.42 ATMEGA2560.3
TXL  (via drill 0.41)
  Top 0.152: FTDI.23 94.02,71.05 94.64,71.05 95.98,72.39 v96.52,72.39 | v96.52,77.47 95.4,78.59 TX.C
  Bottom 0.152: v96.52,72.39 v96.52,77.47
USBVCC  (via drill 0.41)
  Top 0.508: F1.1 74.3,38.1 76.83,40.64 C12.1 77.47,40.64 79.38,38.73 85.09,38.73 86.36,40.01 95.89,40.01 102.87,33.02 102.87,26.67 v104.14,26.67 USB_POWER_ON_LED.A | v104.78,41.91 106.05,41.91 106.68,42.55 T1.1
  Bottom 0.508: v104.78,41.91 104.14,41.27 v104.14,26.67
USHIELD  (via drill 0.41)
  Top 0.305: L1.2 48.26,11.43 50.8,13.97 USB_1.P$1 USB_1.P$2 | Z1.1 99.06,66.04 98.42,66.04 98.42,62.23 Z2.1 97.79,62.23 v88.27,52.7
  Bottom 0.305: v88.27,52.7 64.77,29.21 64.77,13.97 USB_1.P$2
VBACKUP
  Top 0.152: D2.C 26.67,40.01 25.4,38.73 25.4,33.66 | 25.4,33.66 25.4,33.02 JP1.7 | 25.4,33.66 10.79,33.66 10.79,31.75 U1.P$4
VBAT
  Top 0.152: D7.A 15.24,99.69 13.34,101.6 8.89,101.6 X1.2
VCC
  Top 0.152: R19.2 C21.1 83.19,90.17 84.45,88.9 85.72,88.9 85.72,92.08 81.92,92.08 80.64,93.34 U5.8 75.56,93.34 | 75.56,93.34 74.93,93.34 73.03,95.25 R20.2 | JP3.8 77.47,97.79 81.92,97.79 81.92,96.52 78.74,96.52 75.56,93.34
VIN  (via drill 0.35)  (1 unrouted)
  Top 0.152: D3.C v51.44,31.75 50.8,31.75 | 50.8,31.75 46.35,31.75 46.35,30.48 R2.2 45.72,30.48 43.81,32.38 v36.83,32.38 | 50.8,31.75 50.8,36.83 C3.1 | v51.44,27.94 51.44,25.4 PC1.+ | JP1.2 30.48,20.32 31.75,19.05 41.27,19.05 41.27,15.24 IC1.3 | JP2.4 24.77,95.25 24.77,105.41 D12.A | v28.57,88.9 36.83,88.9 | 36.83,88.9 C8.1 | 36.83,88.9 45.72,80.01 46.99,80.01 50.8,76.2 99.69,76.2 107.95,67.94 R6.2
  Bottom 0.152: v51.44,31.75 v51.44,27.94 | JP2.4 28.57,93.34 v28.57,88.9 28.57,40.64 | JP1.2 28.57,22.23 28.57,40.64 | 28.57,40.64 v36.83,32.38
WP
  Top 0.152: JP3.6 81.28,99.06 82.55,99.06 82.55,95.89 81.92,95.25 81.28,95.25 80.64,94.61 U5.7
XTAL1
  Top 0.152: ATMEGA2560.34 56.52,50.16 56.52,48.26 57.15,48.26 58.42,46.99 R5.1 62.23,46.99 64.77,49.53 110.49,49.53 110.49,34.29 Y1.3
XTAL2
  Top 0.152: R5.2 55.88,46.99 55.88,50.16 ATMEGA2560.33 55.88,50.8 55.88,51.44 57.15,52.7 63.5,52.7 65.41,50.8 111.12,50.8 111.12,27.3 110.49,26.67 107.31,26.67 107.31,28.57 107.95,29.21 107.95,34.29 Y1.1
XVCC  (via drill 0.41)
  Top 0.508: v67.31,36.83 68.58,38.1 F1.2
  Bottom 0.508: v67.31,36.83 63.5,33.02 63.5,22.86 59.69,19.05 USB_1.1